# Altium project Rock960 Cape.PrjPcb (part 1 of 2)
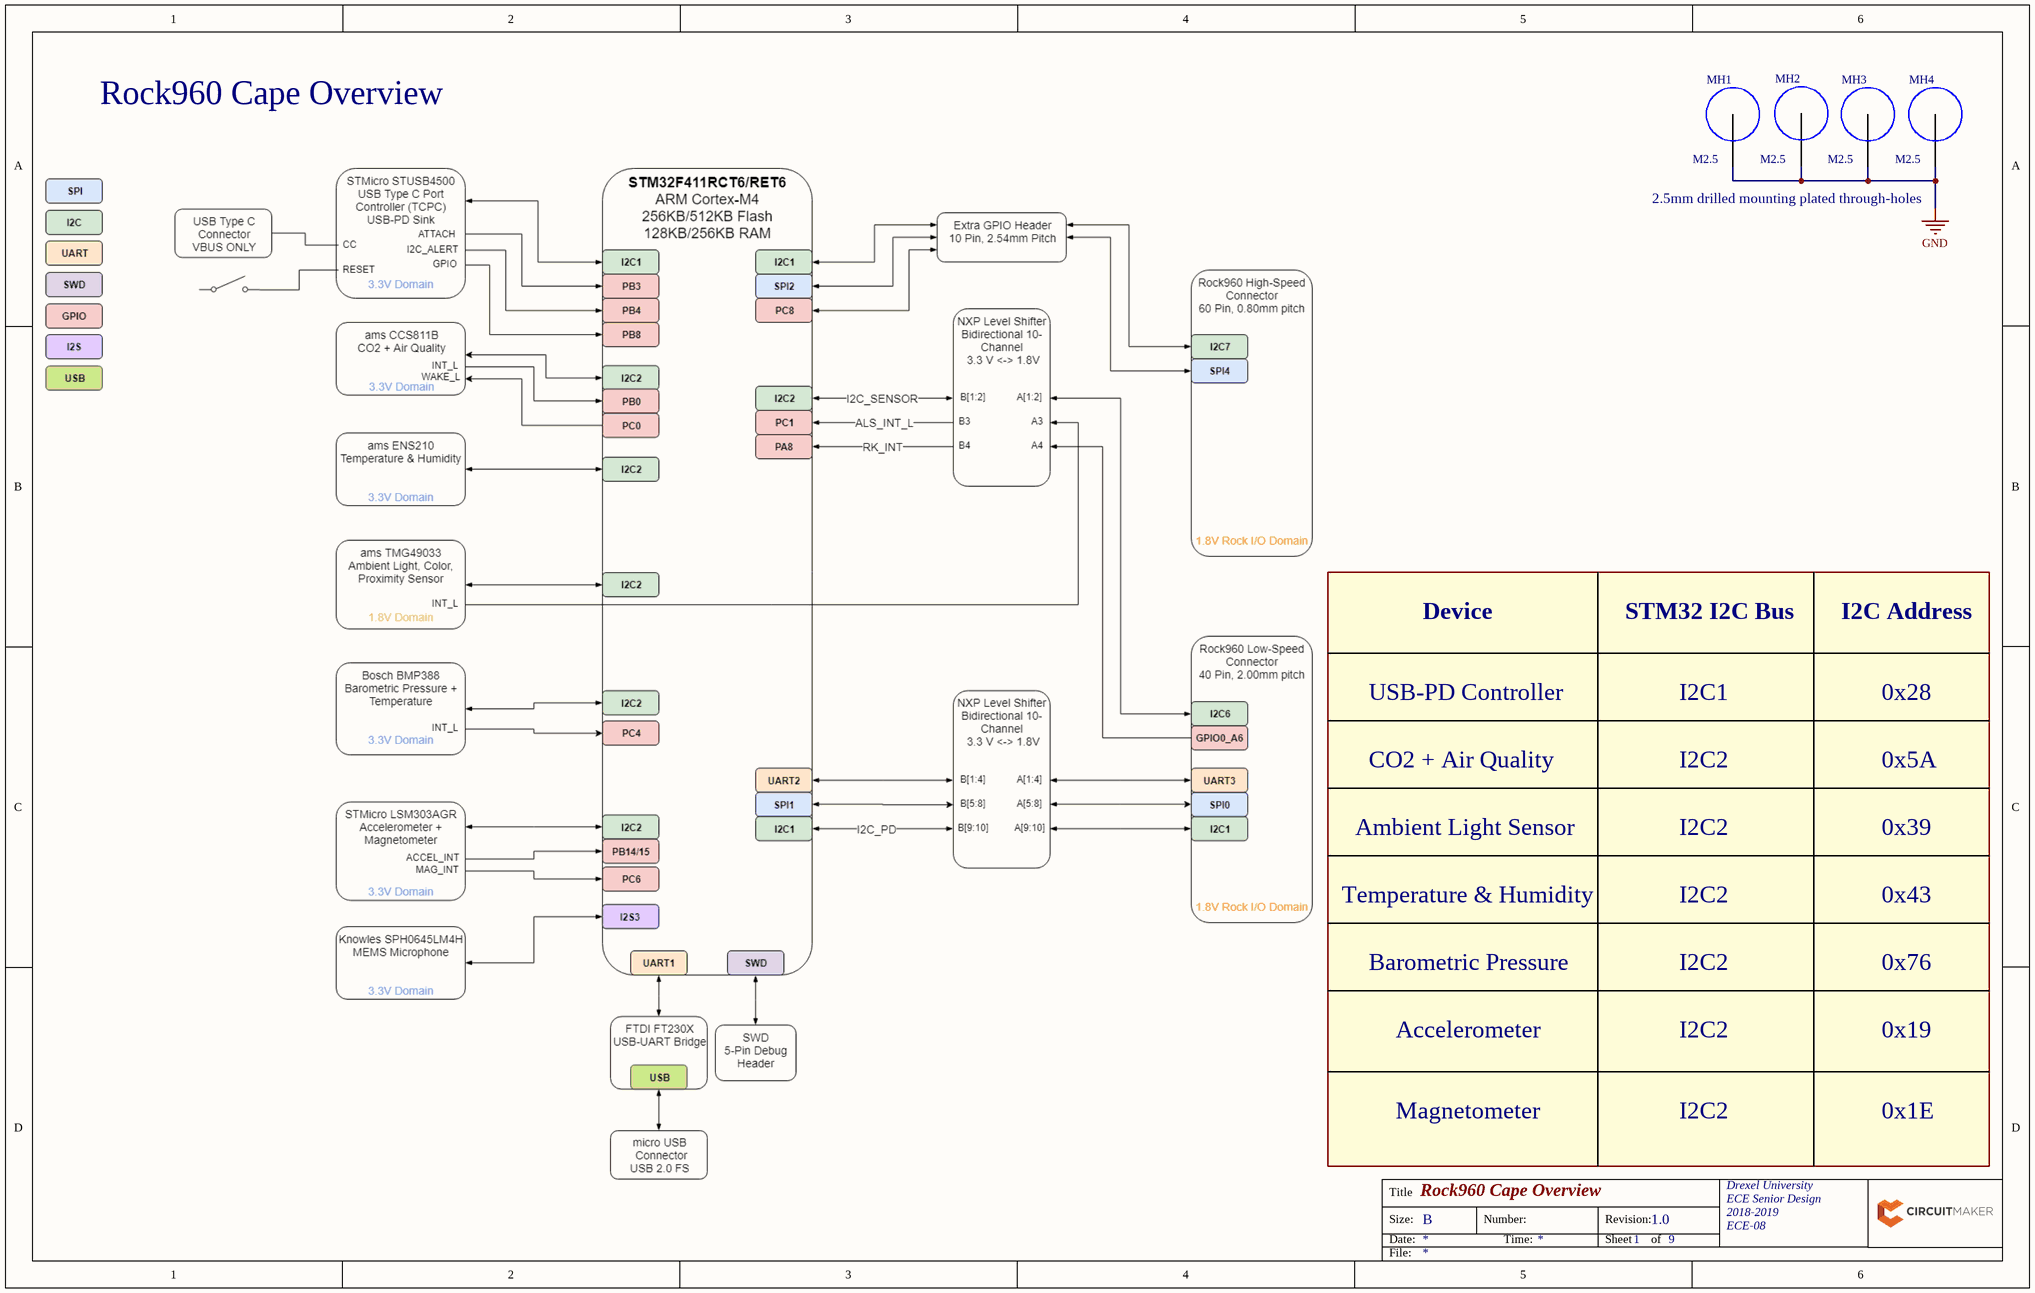
[diagram p0: Cape Overview.SchDoc]
10 sheets, 218 parts. Net scope: flat (ports and power ports of the same name join across sheets).
Sheets:
  Cape Overview.SchDoc
  Board Connectors.SchDoc
  Debug & Test Points.SchDoc
  IO Level Shifters.SchDoc
  USB to UART Bridge.SchDoc
  USB Type C Power Controller.SchDoc
  DC-DC Converters.SchDoc
  STM32F4.SchDoc
  Air Quality Sensors.SchDoc
  Acoustic, Light, Motion Sensors.SchDoc

## Sheet Cape Overview.SchDoc: Rock960 Cape Overview
size B; CompanyName: Drexel University; Organization: Drexel University; Address1: ECE Senior Design; Address2: 2018-2019; Address3: ECE-08; Revision: 1.0; SheetNumber: 1; SheetTotal: 9; ProjectName: Rock960 Cape

### Parts
MH1  M2.5  [PCB-cs3sr3addcss8sioosoo-1]
MH2  M2.5  [PCB-cs3sr3addcss8sioosoo-1]
MH3  M2.5  [PCB-cs3sr3addcss8sioosoo-1]
MH4  M2.5  [PCB-cs3sr3addcss8sioosoo-1]

### Nets
GND: MH1.1 MH2.1 MH3.1 MH4.1

### Notes on the sheet
- Rock960 Cape Overview
- 2.5mm drilled mounting plated through-holes
- Device
- STM32 I2C Bus
- I2C Address
- USB-PD Controller
- I2C1
- 0x28
- CO2 + Air Quality
- I2C2
- 0x5A
- Ambient Light Sensor
- 0x39
- Temperature & Humidity
- 0x43
- Barometric Pressure
- 0x76
- Accelerometer
- 0x19
- Magnetometer
- 0x1E
- Title
- Size:
- Date:
- B
- Number:
- Time:
- Revision:
- Sheet
- of
- File:

### Library data of the parts
MH1-MH4 = CMP-yzeggvgux1nyfm6m4i34-1: Plated Through-Hole Mechanical, 2.5mm drilled, 5.0mm diameter; CustomComponentID: yzeggvgux1nyfm6m4i34

## Sheet Board Connectors.SchDoc: Board Connectors
size B; Organization: Drexel University; Address1: ECE Senior Design; Address2: 2018-2019; Address3: ECE-08; Revision: 1.0; SheetNumber: 2; SheetTotal: 9; ProjectName: Rock960 Cape
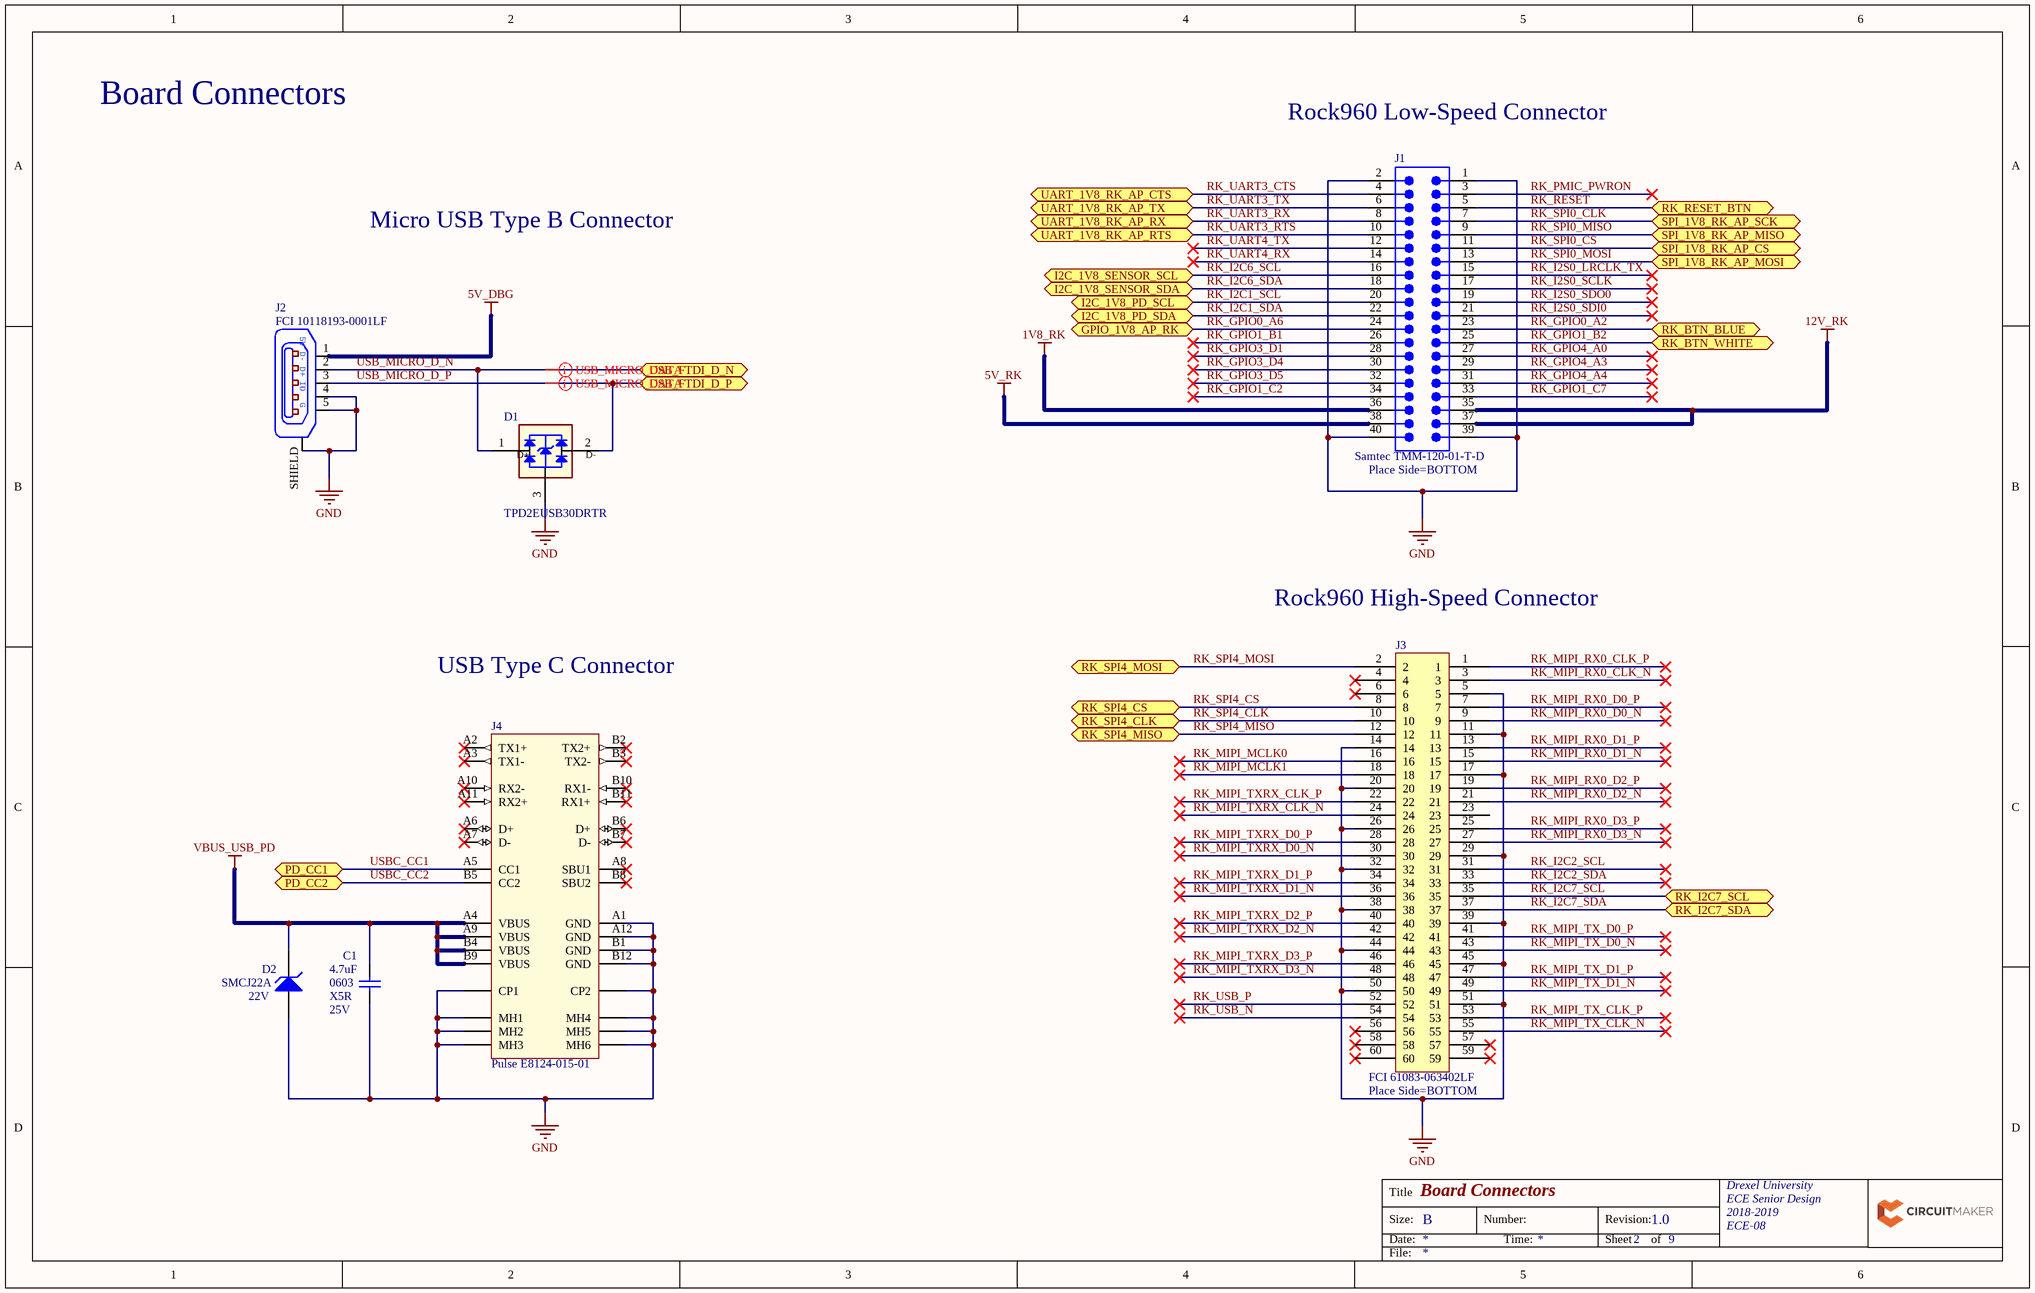
[diagram p1: Board Connectors.SchDoc]

### Parts
C1  Capacitance: 4.7uF  Case/Package: 0603  Dielectric Characteristic: X5R  Voltage Rating (DC): 25V  [CAPC1608X90X35ML10T15]  (hidden comment: Murata GRM188R61E475KE11D)
D1  TPD2EUSB30DRTR  [T_TI_TPD2EUSB30DRTR]
D2  SMCJ22A  Reverse Voltage: 22V  [PCB-gk7qhtajnaxh6qo3xtq4-1]
J1  Samtec TMM-120-01-T-D  [TMM-120-01-T-D]
J2  FCI 10118193-0001LF  [MICRO-USB5+6P-SMD-0.65-B]
J3  FCI 61083-063402LF  [PCB-7ti9pzjasutfjj4nekyo-1]
J4  Pulse E8124-015-01  [PCB-zoek8xqsb2swisfr99my-1]

### Ports
GPIO_1V8_AP_RK, I2C_1V8_PD_SCL (bidir), I2C_1V8_PD_SDA (bidir), I2C_1V8_SENSOR_SCL, I2C_1V8_SENSOR_SDA, PD_CC1 (bidir), PD_CC2 (bidir), RK_BTN_BLUE, RK_BTN_WHITE, RK_I2C7_SCL (bidir), RK_I2C7_SDA (bidir), RK_RESET_BTN, RK_SPI4_CLK (bidir), RK_SPI4_CS (bidir), RK_SPI4_MISO (bidir), RK_SPI4_MOSI (bidir), SPI_1V8_RK_AP_CS, SPI_1V8_RK_AP_MISO, SPI_1V8_RK_AP_MOSI, SPI_1V8_RK_AP_SCK, UART_1V8_RK_AP_CTS, UART_1V8_RK_AP_RTS, UART_1V8_RK_AP_RX, UART_1V8_RK_AP_TX, USB_FTDI_D_N, USB_FTDI_D_P

### Nets
1V8_RK: J1.36
5V_DBG: J2.1
5V_RK: J1.38
12V_RK: J1.35 J1.37
GND: C1.1 D1.3(GND) D2.1(A) J1.1 J1.2 J1.39 J1.40 J2.4 J2.5 J2.SHIELD J3.5 J3.11 J3.14 J3.17 J3.20 J3.26 J3.29 J3.32 J3.38 J3.39 J3.44 J3.45 J3.50 J3.51 J4.A1(GND) J4.A12(GND) J4.B1(GND) J4.B12(GND) J4.CP1 J4.CP2 J4.MH1 J4.MH2 J4.MH3 J4.MH4 J4.MH5 J4.MH6
VBUS_USB_PD: C1.2 D2.2(K) J4.A4(VBUS) J4.A9(VBUS) J4.B4(VBUS) J4.B9(VBUS)
RK_GPIO0_A2: J1.23 ; port RK_BTN_BLUE
RK_GPIO0_A6: J1.24 ; port GPIO_1V8_AP_RK
RK_GPIO1_B1: J1.26
RK_GPIO1_B2: J1.25 ; port RK_BTN_WHITE
RK_GPIO1_C2: J1.34
RK_GPIO1_C7: J1.33
RK_GPIO3_D1: J1.28
RK_GPIO3_D4: J1.30
RK_GPIO3_D5: J1.32
RK_GPIO4_A0: J1.27
RK_GPIO4_A3: J1.29
RK_GPIO4_A4: J1.31
RK_I2C1_SCL: J1.20 ; port I2C_1V8_PD_SCL
RK_I2C1_SDA: J1.22 ; port I2C_1V8_PD_SDA
RK_I2C2_SCL: J3.31
RK_I2C2_SDA: J3.33
RK_I2C6_SCL: J1.16 ; port I2C_1V8_SENSOR_SCL
RK_I2C6_SDA: J1.18 ; port I2C_1V8_SENSOR_SDA
RK_I2C7_SCL: J3.35 ; port RK_I2C7_SCL
RK_I2C7_SDA: J3.37 ; port RK_I2C7_SDA
RK_I2S0_LRCLK_TX: J1.15
RK_I2S0_SCLK: J1.17
RK_I2S0_SDI0: J1.21
RK_I2S0_SDO0: J1.19
RK_MIPI_MCLK0: J3.16
RK_MIPI_MCLK1: J3.18
RK_MIPI_RX0_CLK_N: J3.3
RK_MIPI_RX0_CLK_P: J3.1
RK_MIPI_RX0_D0_N: J3.9
RK_MIPI_RX0_D0_P: J3.7
RK_MIPI_RX0_D1_N: J3.15
RK_MIPI_RX0_D1_P: J3.13
RK_MIPI_RX0_D2_N: J3.21
RK_MIPI_RX0_D2_P: J3.19
RK_MIPI_RX0_D3_N: J3.27
RK_MIPI_RX0_D3_P: J3.25
RK_MIPI_TX_CLK_N: J3.55
RK_MIPI_TX_CLK_P: J3.53
RK_MIPI_TX_D0_N: J3.43
RK_MIPI_TX_D0_P: J3.41
RK_MIPI_TX_D1_N: J3.49
RK_MIPI_TX_D1_P: J3.47
RK_MIPI_TXRX_CLK_N: J3.24
RK_MIPI_TXRX_CLK_P: J3.22
RK_MIPI_TXRX_D0_N: J3.30
RK_MIPI_TXRX_D0_P: J3.28
RK_MIPI_TXRX_D1_N: J3.36
RK_MIPI_TXRX_D1_P: J3.34
RK_MIPI_TXRX_D2_N: J3.42
RK_MIPI_TXRX_D2_P: J3.40
RK_MIPI_TXRX_D3_N: J3.48
RK_MIPI_TXRX_D3_P: J3.46
RK_PMIC_PWRON: J1.3
RK_RESET: J1.5 ; port RK_RESET_BTN
RK_SPI0_CLK: J1.7 ; port SPI_1V8_RK_AP_SCK
RK_SPI0_CS: J1.11 ; port SPI_1V8_RK_AP_CS
RK_SPI0_MISO: J1.9 ; port SPI_1V8_RK_AP_MISO
RK_SPI0_MOSI: J1.13 ; port SPI_1V8_RK_AP_MOSI
RK_SPI4_CLK: J3.10 ; port RK_SPI4_CLK
RK_SPI4_CS: J3.8 ; port RK_SPI4_CS
RK_SPI4_MISO: J3.12 ; port RK_SPI4_MISO
RK_SPI4_MOSI: J3.2 ; port RK_SPI4_MOSI
RK_UART3_CTS: J1.4 ; port UART_1V8_RK_AP_CTS
RK_UART3_RTS: J1.10 ; port UART_1V8_RK_AP_RTS
RK_UART3_RX: J1.8 ; port UART_1V8_RK_AP_RX
RK_UART3_TX: J1.6 ; port UART_1V8_RK_AP_TX
RK_UART4_RX: J1.14
RK_UART4_TX: J1.12
RK_USB_N: J3.54
RK_USB_P: J3.52
USB_MICRO_D_N: D1.1(D+) J2.2 ; port USB_FTDI_D_N
USB_MICRO_D_P: D1.2(D-) J2.3 ; port USB_FTDI_D_P
USBC_CC1: J4.A5(CC1) ; port PD_CC1
USBC_CC2: J4.B5(CC2) ; port PD_CC2

Not connected (* = marked no-connect by the designer): J3 4* 6* 23 56* 57* 58* 59* 60*; J4 A2(TX1+)* A3(TX1-)* A6(D+)* A7(D-)* A8(SBU1)* A10(RX2-)* A11(RX2+)* B2(TX2+)* B3(TX2-)* B6(D+)* B7(D-)* B8(SBU2)* B10(RX1-)* B11(RX1+)*

### Layout directives
differential pair: USB_MICRO_D_N, USB_MICRO_D_P

### Notes on the sheet
- Board Connectors
- Rock960 Low-Speed Connector
- Micro USB Type B Connector
- (near J1) Place Side=BOTTOM
- Rock960 High-Speed Connector
- USB Type C Connector
- (near J3) Place Side=BOTTOM
- Title
- Size:
- Date:
- B
- Number:
- Time:
- Revision:
- Sheet
- of
- File:
- (in symbol CMP-b7d77f99eeaa6810-17) 5V; D-; D+; ID; G

### Library data of the parts
C1 = CMP-8856396-4: CAP CER 4.7UF 25V 10% X5R 0603; Capacitance Tolerance: ±10%; Lifecycle Status: Active; Octopart Url: https://octopart.com/grm188r61e475ke11d-murata-26982327; OctopartID: 0176c9e793a7deb1; Packaging: Cut Tape (CT); REACH SVHC Compliance: No SVHC; RoHS: Compliant; Size-Length: 0.0016 m; Size-Thickness: 0.0008 m; Size-Width: 0.0008 m; Manufacturer Part Number: GRM188R61E475KE11D
D1 = CMP-19307392-6: 2-Channel ESD Solution for SuperSpeed USB 3.0 Interface 3-SOT -40 to 85; Manufacturer Name: Texas Instruments; Lead-Free Status: Lead Free; Number of Channels: 2; Operating Voltage: 5.5V; Clamp Voltage: 8.0V; Capacitance: 700 fF; Manufacturer Part No.: TPD2EUSB30DRTR; Number of Pins: 3; RoHS: Compliant; Packaging: Tape & Reel (TR), Cut Tape (CT); Lifecycle Status: Active; Manufacturer Part Number: TPD2EUSB30DRTR; Octopart URL: http://octopart.com/tpd2eusb30drtr-texas+instruments-18093488; REACH SVHC Compliance: No SVHC; OctopartID: 42478a5972919d80
D2 = CMP-9cf25530e9434335-1: SMCJ Series 35.5 V 1.5 kW Surface Mount Uni-Directional TVS Diode - DO-214AB
J1 = CMP-43228a2c51039ce5-1: Conn Unshrouded Header HDR 40 POS 2mm Solder ST Thru-Hole; Gender: Male; Lead-Free Status: Lead Free; Number of Contacts: 40; Pin Pitch: 2.00 mm; Octopart URL: https://octopart.com/tmm-120-01-t-d-samtec-276295; Manufacturer Part Number: TMM-120-01-T-D; Color: Black; Contact Material: Phosphor Bronze; Contact Plating: Tin; Housing Color: Black; Housing Material: Plastic; Mounting Style: Through Hole, Vertical; Number of Positions: 40; Number of Rows: 2; Operating Temperature: 105 °C (max); Packaging: Tube; REACH SVHC Compliance: No SVHC; RoHS: Compliant; Size-Height: 1.50 mm; Size-Length: 40.0 mm; Size-Width: 3.94 mm; OctopartID: 43228a2c51039ce5
J2 = CMP-b7d77f99eeaa6810-17: Conn Micro USB Type B RCP 5 POS 0.65mm Solder RA SMD 5 Terminal 1 Port T/R
J3 = CMP-fca037f0475d2367-2: Bergstak® : 60 Positions; Dual Row; BTBVertical Header tape & Reel; Gender: Male; Pin Pitch: 800 µm; Contact Resistance: 50.0 mΩ (max); Number of Contacts: 60; Flammability Rating: UL 94 V-0; Orientation: Vertical; Contact Plating: Gold; Size-Height: 6.70 mm; RoHS: Compliant; Mounting Style: Surface Mount, Vertical; Size-Length: 29.8 mm; Number of Rows: 2; Contact Material: Brass; OctopartID: fca037f0475d2367
J4 = CMP-5cde91da6a388319-4: Conn USB Type C RCP 24 POS 0.5mm Solder RA SMD 24 Terminal 1 Port

## Sheet Debug & Test Points.SchDoc: Debug & Test Points
size B; Organization: Drexel University; Address1: ECE Senior Design; Address2: 2018-2019; Address3: ECE-08; Revision: 1.0; SheetNumber: 3; SheetTotal: 9; PageSetup: Record=PageOptions|CenterHorizontal=True|CenterVertical=True|PrintScale=1.00|XCorrection=1.00|YCorrection=1.00|PrintKind=0|BorderSize=5000000|LeftOffset=0|BottomOffset=0|Orientation=2|PaperLength=1000|PaperWidth=1000|Scale=100|PaperSource=7|PrintQuality=-3|MediaType=1|DitherType=10|PrintScaleMode=1|PaperKind=Letter|PaperIndex=1
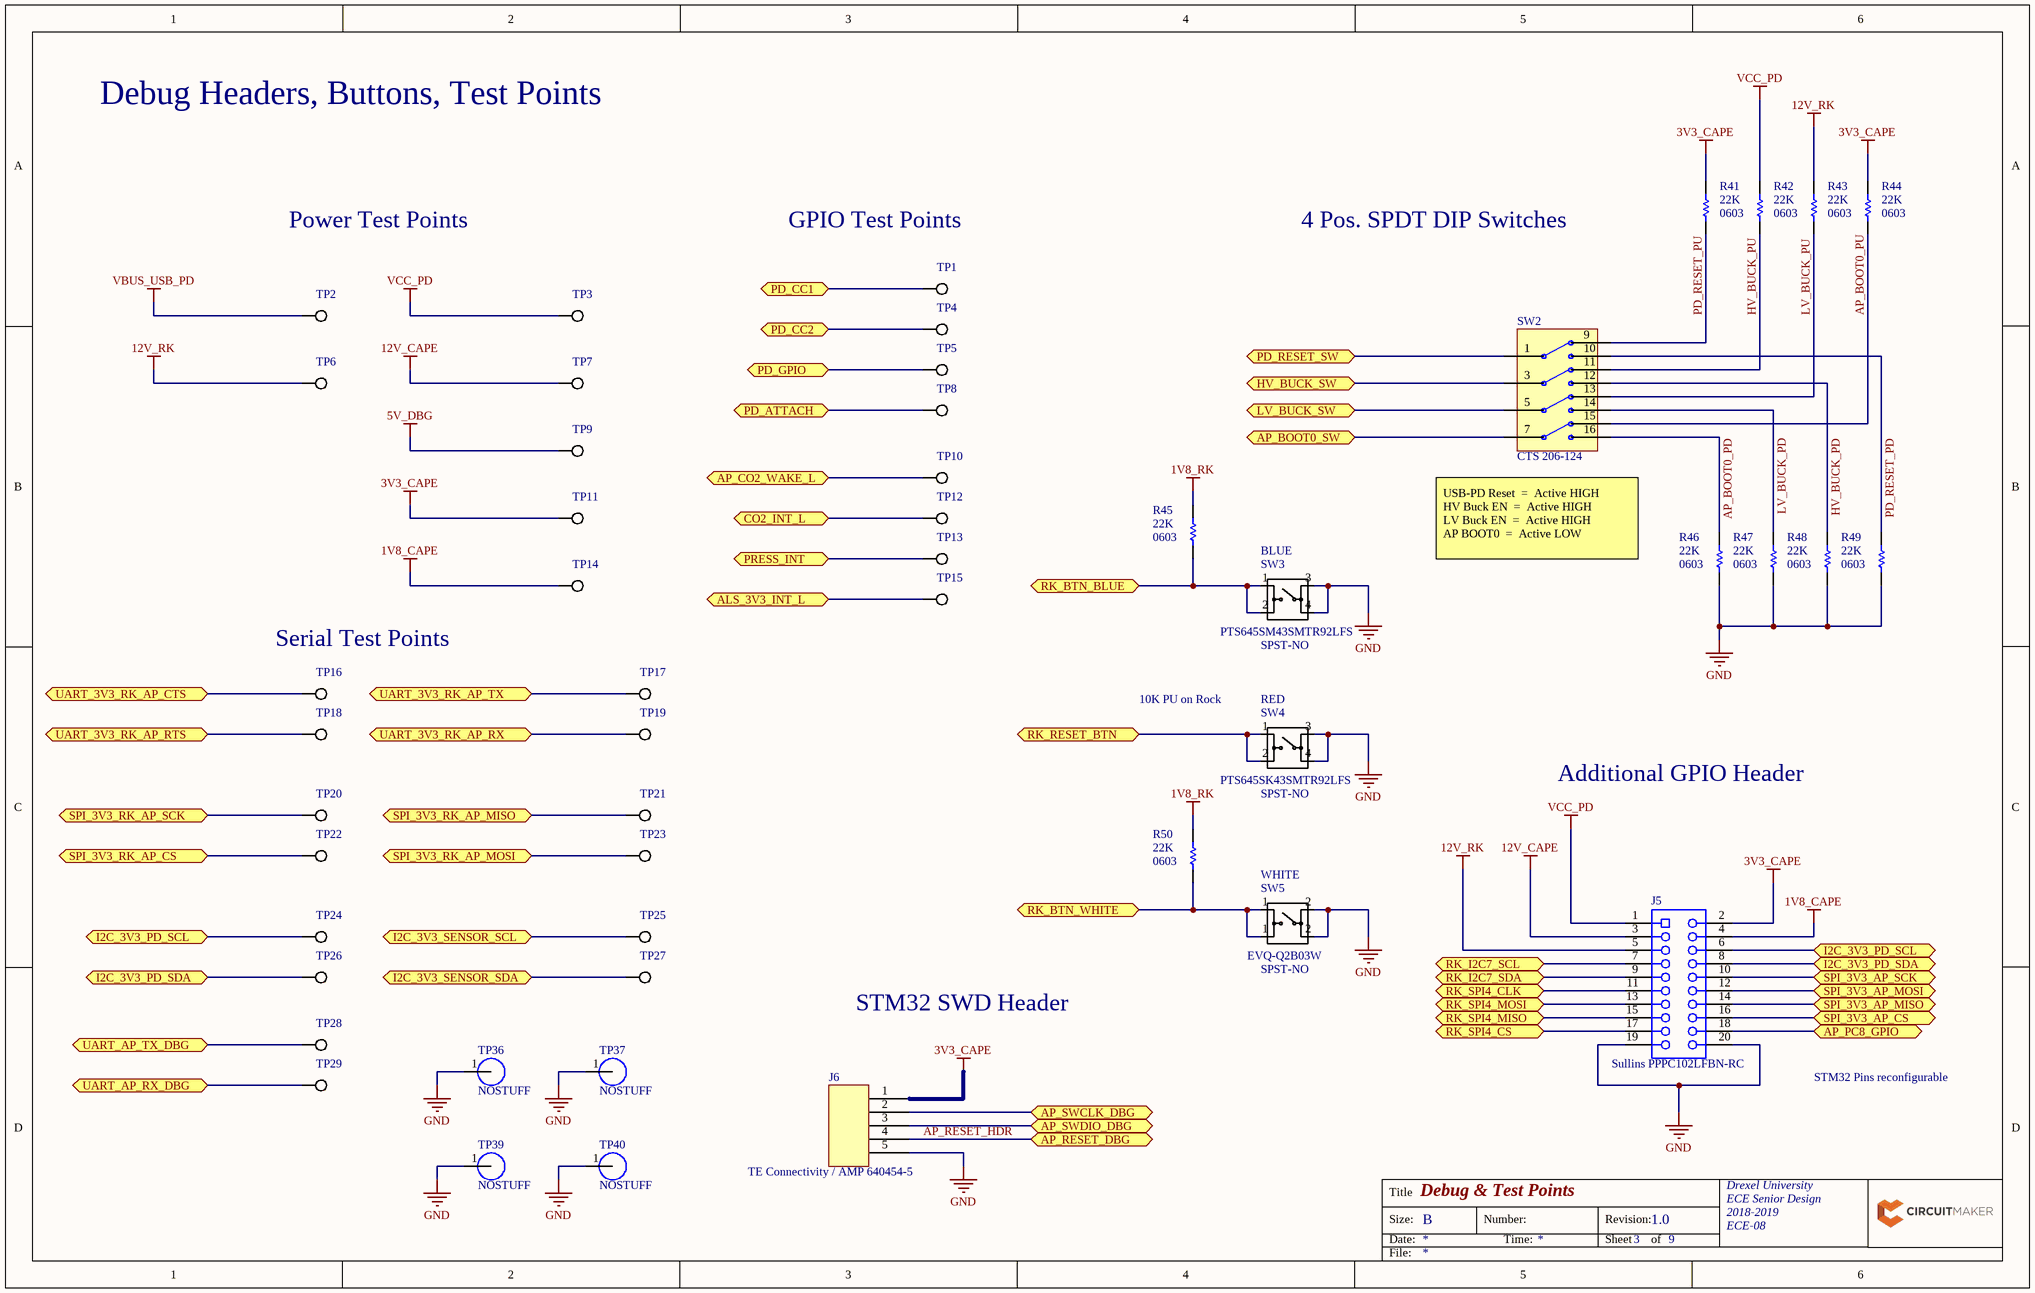
[diagram p2: Debug & Test Points.SchDoc]

### Parts
J5  Sullins PPPC102LFBN-RC  [SLIN-PPPC102LFBN-RC_V]
J6  TE Connectivity / AMP 640454-5  [PCB-cjz7utnpmh9dagnjcosy-1]
R41  Resistance: 22K  Case/Package: 0603  [RESC1608X55X25LL10T15]  (hidden comment: Yageo RC0603FR-0722KL)
R42  Resistance: 22K  Case/Package: 0603  [RESC1608X55X25LL10T15]  (hidden comment: Yageo RC0603FR-0722KL)
R43  Resistance: 22K  Case/Package: 0603  [RESC1608X55X25LL10T15]  (hidden comment: Yageo RC0603FR-0722KL)
R44  Resistance: 22K  Case/Package: 0603  [RESC1608X55X25LL10T15]  (hidden comment: Yageo RC0603FR-0722KL)
R45  Resistance: 22K  Case/Package: 0603  [RESC1608X55X25LL10T15]  (hidden comment: Yageo RC0603FR-0722KL)
R46  Resistance: 22K  Case/Package: 0603  [RESC1608X55X25LL10T15]  (hidden comment: Yageo RC0603FR-0722KL)
R47  Resistance: 22K  Case/Package: 0603  [RESC1608X55X25LL10T15]  (hidden comment: Yageo RC0603FR-0722KL)
R48  Resistance: 22K  Case/Package: 0603  [RESC1608X55X25LL10T15]  (hidden comment: Yageo RC0603FR-0722KL)
R49  Resistance: 22K  Case/Package: 0603  [RESC1608X55X25LL10T15]  (hidden comment: Yageo RC0603FR-0722KL)
R50  Resistance: 22K  Case/Package: 0603  [RESC1608X55X25LL10T15]  (hidden comment: Yageo RC0603FR-0722KL)
SW2  CTS 206-124  [PCB-nbvsi55tyuro9im52r90-1]
SW3  Manufacturer Part Number: PTS645SM43SMTR92LFS  Contacts Type: SPST-NO  [PCB-s4cw3ztviwh2470uqn6q-1]  (hidden comment: C&K Components PTS645SM43SMTR92LFS)
SW4  Manufacturer Part Number: PTS645SK43SMTR92LFS  Contacts Type: SPST-NO  [PCB-2l25iuk5dcek232nr8ss-1]  (hidden comment: C&K Components PTS645SK43SMTR92LFS)
SW5  Manufacturer Part Number: EVQ-Q2B03W  Contacts Type: SPST-NO  [PCB-772q97a3nev1hwheshwj-1]  (hidden comment: Panasonic EVQ-Q2B03W)
TP1  SYM-r3tntvff39g057zxjnnx-1  [PCB-hew5anfrhkqvtgt23eko-1]  (value not drawn)
TP2  SYM-r3tntvff39g057zxjnnx-1  [PCB-hew5anfrhkqvtgt23eko-1]  (value not drawn)
TP3  SYM-r3tntvff39g057zxjnnx-1  [PCB-hew5anfrhkqvtgt23eko-1]  (value not drawn)
TP4  SYM-r3tntvff39g057zxjnnx-1  [PCB-hew5anfrhkqvtgt23eko-1]  (value not drawn)
TP5  SYM-r3tntvff39g057zxjnnx-1  [PCB-hew5anfrhkqvtgt23eko-1]  (value not drawn)
TP6  SYM-r3tntvff39g057zxjnnx-1  [PCB-hew5anfrhkqvtgt23eko-1]  (value not drawn)
TP7  SYM-r3tntvff39g057zxjnnx-1  [PCB-hew5anfrhkqvtgt23eko-1]  (value not drawn)
TP8  SYM-r3tntvff39g057zxjnnx-1  [PCB-hew5anfrhkqvtgt23eko-1]  (value not drawn)
TP9  SYM-r3tntvff39g057zxjnnx-1  [PCB-hew5anfrhkqvtgt23eko-1]  (value not drawn)
TP10  SYM-r3tntvff39g057zxjnnx-1  [PCB-hew5anfrhkqvtgt23eko-1]  (value not drawn)
TP11  SYM-r3tntvff39g057zxjnnx-1  [PCB-hew5anfrhkqvtgt23eko-1]  (value not drawn)
TP12  SYM-r3tntvff39g057zxjnnx-1  [PCB-hew5anfrhkqvtgt23eko-1]  (value not drawn)
TP13  SYM-r3tntvff39g057zxjnnx-1  [PCB-hew5anfrhkqvtgt23eko-1]  (value not drawn)
TP14  SYM-r3tntvff39g057zxjnnx-1  [PCB-hew5anfrhkqvtgt23eko-1]  (value not drawn)
TP15  SYM-r3tntvff39g057zxjnnx-1  [PCB-hew5anfrhkqvtgt23eko-1]  (value not drawn)
TP16  SYM-r3tntvff39g057zxjnnx-1  [PCB-hew5anfrhkqvtgt23eko-1]  (value not drawn)
TP17  SYM-r3tntvff39g057zxjnnx-1  [PCB-hew5anfrhkqvtgt23eko-1]  (value not drawn)
TP18  SYM-r3tntvff39g057zxjnnx-1  [PCB-hew5anfrhkqvtgt23eko-1]  (value not drawn)
TP19  SYM-r3tntvff39g057zxjnnx-1  [PCB-hew5anfrhkqvtgt23eko-1]  (value not drawn)
TP20  SYM-r3tntvff39g057zxjnnx-1  [PCB-hew5anfrhkqvtgt23eko-1]  (value not drawn)
TP21  SYM-r3tntvff39g057zxjnnx-1  [PCB-hew5anfrhkqvtgt23eko-1]  (value not drawn)
TP22  SYM-r3tntvff39g057zxjnnx-1  [PCB-hew5anfrhkqvtgt23eko-1]  (value not drawn)
TP23  SYM-r3tntvff39g057zxjnnx-1  [PCB-hew5anfrhkqvtgt23eko-1]  (value not drawn)
TP24  SYM-r3tntvff39g057zxjnnx-1  [PCB-hew5anfrhkqvtgt23eko-1]  (value not drawn)
TP25  SYM-r3tntvff39g057zxjnnx-1  [PCB-hew5anfrhkqvtgt23eko-1]  (value not drawn)
TP26  SYM-r3tntvff39g057zxjnnx-1  [PCB-hew5anfrhkqvtgt23eko-1]  (value not drawn)
TP27  SYM-r3tntvff39g057zxjnnx-1  [PCB-hew5anfrhkqvtgt23eko-1]  (value not drawn)
TP28  SYM-r3tntvff39g057zxjnnx-1  [PCB-hew5anfrhkqvtgt23eko-1]  (value not drawn)
TP29  SYM-r3tntvff39g057zxjnnx-1  [PCB-hew5anfrhkqvtgt23eko-1]  (value not drawn)
TP36  Keystone 5015  [PCB-57fxnr3lnfj79tb7d57h-1]  (value not drawn)  (no BOM)
TP37  Keystone 5015  [PCB-57fxnr3lnfj79tb7d57h-1]  (value not drawn)  (no BOM)
TP39  Keystone 5015  [PCB-57fxnr3lnfj79tb7d57h-1]  (value not drawn)  (no BOM)
TP40  Keystone 5015  [PCB-57fxnr3lnfj79tb7d57h-1]  (value not drawn)  (no BOM)

### Ports
ALS_3V3_INT_L, AP_BOOT0_SW, AP_CO2_WAKE_L, AP_PC8_GPIO, AP_RESET_DBG, AP_SWCLK_DBG, AP_SWDIO_DBG, CO2_INT_L, HV_BUCK_SW, I2C_3V3_PD_SCL, I2C_3V3_PD_SCL (bidir), I2C_3V3_PD_SDA, I2C_3V3_PD_SDA (bidir), I2C_3V3_SENSOR_SCL, I2C_3V3_SENSOR_SDA, LV_BUCK_SW, PD_ATTACH, PD_CC1 (bidir), PD_CC2 (bidir), PD_GPIO, PD_RESET_SW (bidir), PRESS_INT, RK_BTN_BLUE, RK_BTN_WHITE, RK_I2C7_SCL (bidir), RK_I2C7_SDA (bidir), RK_RESET_BTN, RK_SPI4_CLK (bidir), RK_SPI4_CS (bidir), RK_SPI4_MISO (bidir), RK_SPI4_MOSI (bidir), SPI_3V3_AP_CS, SPI_3V3_AP_MISO, SPI_3V3_AP_MOSI, SPI_3V3_AP_SCK, SPI_3V3_RK_AP_CS, SPI_3V3_RK_AP_MISO, SPI_3V3_RK_AP_MOSI, SPI_3V3_RK_AP_SCK, UART_3V3_RK_AP_CTS, UART_3V3_RK_AP_RTS, UART_3V3_RK_AP_RX, UART_3V3_RK_AP_TX, UART_AP_RX_DBG, UART_AP_TX_DBG

### Nets
1V8_CAPE: J5.4 TP14.1
1V8_RK: R45.2 R50.2
3V3_CAPE: J5.2 J6.1 R41.2 R44.2 TP11.1
5V_DBG: TP9.1
12V_CAPE: J5.3 TP7.1
12V_RK: J5.5 R43.2 TP6.1
GND: J5.19 J5.20 J6.5 R46.1 R47.1 R48.1 R49.1 SW3.3 SW3.4 SW4.3 SW4.4 SW5.2 TP36.1 TP37.1 TP39.1 TP40.1
VBUS_USB_PD: TP2.1
VCC_PD: J5.1 R42.2 TP3.1
AP_BOOT0_PD: R46.2 SW2.16
AP_BOOT0_PU: R44.1 SW2.15
AP_BOOT0_SEL: SW2.7 ; port AP_BOOT0_SW
AP_I2C1_SCL: J5.6 TP24.1 ; port I2C_3V3_PD_SCL
AP_I2C1_SDA: J5.8 TP26.1 ; port I2C_3V3_PD_SDA
AP_I2C2_SCL: TP25.1 ; port I2C_3V3_SENSOR_SCL
AP_I2C2_SDA: TP27.1 ; port I2C_3V3_SENSOR_SDA
AP_PB1_CO2_INT: TP12.1 ; port CO2_INT_L
AP_PB4_PD_ATTACH: TP8.1 ; port PD_ATTACH
AP_PB8_PD_GPIO: TP5.1 ; port PD_GPIO
AP_PC0_CO2_WAKE_L: TP10.1 ; port AP_CO2_WAKE_L
AP_PC1_ALS_INT_L: TP15.1 ; port ALS_3V3_INT_L
AP_PC4_PRESS_INT: TP13.1 ; port PRESS_INT
AP_PC8: J5.18 ; port AP_PC8_GPIO
AP_RESET_HDR: J6.4 ; port AP_RESET_DBG
AP_SPI1_MISO: TP21.1 ; port SPI_3V3_RK_AP_MISO
AP_SPI1_MOSI: TP23.1 ; port SPI_3V3_RK_AP_MOSI
AP_SPI1_SCK: TP20.1 ; port SPI_3V3_RK_AP_SCK
AP_SPI1_SLAVE_NSS: TP22.1 ; port SPI_3V3_RK_AP_CS
AP_SPI2_MISO: J5.14 ; port SPI_3V3_AP_MISO
AP_SPI2_MOSI: J5.12 ; port SPI_3V3_AP_MOSI
AP_SPI2_MSTR_NSS: J5.16 ; port SPI_3V3_AP_CS
AP_SPI2_SCK: J5.10 ; port SPI_3V3_AP_SCK
AP_SWCLK: J6.2 ; port AP_SWCLK_DBG
AP_SWDIO: J6.3 ; port AP_SWDIO_DBG
AP_UART1_RX: TP29.1 ; port UART_AP_RX_DBG
AP_UART1_TX: TP28.1 ; port UART_AP_TX_DBG
AP_UART2_CTS: TP18.1 ; port UART_3V3_RK_AP_RTS
AP_UART2_RTS: TP16.1 ; port UART_3V3_RK_AP_CTS
AP_UART2_RX: TP17.1 ; port UART_3V3_RK_AP_TX
AP_UART2_TX: TP19.1 ; port UART_3V3_RK_AP_RX
HV_BUCK_EN: SW2.3 ; port HV_BUCK_SW
HV_BUCK_PD: R48.2 SW2.12
HV_BUCK_PU: R42.1 SW2.11
LV_BUCK_EN: SW2.5 ; port LV_BUCK_SW
LV_BUCK_PD: R47.2 SW2.14
LV_BUCK_PU: R43.1 SW2.13
PD_RESET: SW2.1 ; port PD_RESET_SW
PD_RESET_PD: R49.2 SW2.10
PD_RESET_PU: R41.1 SW2.9
RK_GPIO0_A2: R45.1 SW3.1 SW3.2 ; port RK_BTN_BLUE
RK_GPIO1_B2: R50.1 SW5.1 ; port RK_BTN_WHITE
RK_I2C7_SCL: J5.7 ; port RK_I2C7_SCL
RK_I2C7_SDA: J5.9 ; port RK_I2C7_SDA
RK_RESET: SW4.1 SW4.2 ; port RK_RESET_BTN
RK_SPI4_CLK: J5.11 ; port RK_SPI4_CLK
RK_SPI4_CS: J5.17 ; port RK_SPI4_CS
RK_SPI4_MISO: J5.15 ; port RK_SPI4_MISO
RK_SPI4_MOSI: J5.13 ; port RK_SPI4_MOSI
USBC_CC1: TP1.1 ; port PD_CC1
USBC_CC2: TP4.1 ; port PD_CC2

### Notes on the sheet
- Debug Headers, Buttons, Test Points
- Power Test Points
- GPIO Test Points
- 4 Pos. SPDT DIP Switches
- (near SW3) BLUE
- (near SW2) USB-PD Reset  =  Active HIGH
  HV Buck EN  =  Active HIGH
  LV Buck EN  =  Active HIGH
  AP BOOT0  =  Active LOW
- (near TP16) Serial Test Points
- 10K PU on Rock
- (near SW4) RED
- Additional GPIO Header
- (near SW5) WHITE
- STM32 SWD Header
- STM32 Pins reconfigurable
- Title
- Size:
- Date:
- B
- Number:
- Time:
- Revision:
- Sheet
- of
- File:
- (in symbol CMP-0dc8c4c22640d20f-15) NOSTUFF

### Library data of the parts
J5 = CMP-dcfd15f3db31033a-2: Female Header, Pitch 2.54 mm, 2 x 10 Position, Height 8.75 mm, Tail Length 3.2 mm, -40 to 105 degC, RoHS, Bulk; Pin Pitch: 2.54 mm; Number of Positions: 20; Lead-Free Status: Lead Free; Housing Material: Plastic; ComponentLink1Description: Datasheet; RoHS: Compliant; Number of Rows: 2; Contact Plating: Gold; Octopart Url: http://octopart.com/pppc102lfbn-rc-sullins-271018; Contact Material: Phosphor Bronze; DatasheetVersion: Rev. D, 10/2007; Size-Height: 8.50 mm; Size-Width: 5.00 mm; Seller Landing  Url: https://octopart.com/click/track?country=US&ak=8157f166&sig=09905bc&sid=459&ppid=271018&vpid=1792693&ct=offers; ComponentLink1URL: http://datasheet.octopart.com/PPPC102LFBN-RC-Sullins-datasheet-8327184.pdf; Mounting Style: Through Hole; PackageDescription: Female Header, Pitch 2.54 mm, 2 x 10 Position, Height 8.75 mm, Tail Length 3.2 mm; PackageReference: PPPC102LFBN-RC; OctopartID: dcfd15f3db31033a; Manufacturer Part Number: PPPC102LFBN-RC; Size-Length: 25.9 mm
J6 = CMP-334df81e3a21ec8a-6: MTA-100 5 Position 2.54 mm Single Row Through-Hole Straight Wire to Board Header; Pin Pitch: 2.54 mm; Mounting Angle: 180 °; ELV Compliant: Compliant; Current Rating: 4.00 A; Gender: Male; Number of Contacts: 5; Lead-Free Status: Lead Free; Shrouded: No; Voltage Rating (AC): 250 V; Contact Plating: Tin; OctopartID: 334df81e3a21ec8a; Packaging: Bag; Orientation: Vertical; Mounting Style: Through Hole, Vertical; Contact Material: Copper Alloy; Size-Height: 7.87 mm; Octopart URL: http://octopart.com/640454-5-te+connectivity+%2F+amp-39398410; Housing Color: Natural; Size-Length: 12.7 mm; Number of Positions: 5; Flammability Rating: UL 94 V-0; Manufacturer Part Number: 640454-5; Lifecycle Status: Active; Number of Rows: 1; Size-Width: 5.71 mm; RoHS: Compliant; Housing Material: Polyester; REACH SVHC Compliance: No SVHC
R41-R50 = CMP-1853446-5: Chip Resistor, 22 KOhm, +/- 1%, 0.1 W, -55 to 155 degC, 0603 (1608 Metric), RoHS, Tape and Reel; Power Rating: 1/10W; Voltage Rating (DC): 50.0 V; Lead-Free Status: Lead Free; Case/Package (SI): 1608; Number of Pins: 2; Size-Height: 450 µm; Resistance Tolerance: 1%; PackageDescription: 2-Pin Surface Mount Device, Body 1.6 x 0.8 mm; Size-Width: 800 µm; Seller Landing  Url: https://octopart-clicks.com/click/track?country=US&ak=8157f166&sig=0952a08&sid=5489&ppid=40952860&vpid=270386233&ct=offers; DatasheetVersion: Rev. 4, 02/2016; PackageReference: 0603; Size-Length: 1.60 mm; RoHS: Compliant; Mounting Style: Surface Mount; OctopartID: 2162ea18e018fea5; Manufacturer Part Number: RC0603FR-0722KL; Packaging: Cut Tape (CT), Tape & Reel (TR); Octopart Url: http://octopart.com/rc0603fr-0722kl-yageo-40952860; REACH SVHC Compliance: No SVHC
SW2 = CMP-9d2d5432b3d942ea-1: Switch DIP OFF ON SPDT 4 Raised Slide 0.05A 24VDC PC Pins 10000Cycles 2.54mm Thru-Hole Tube; Actuator Type: Standard; Carry Current: 100 mA (max); Lead-Free Status: Contains Lead; Number of Positions: 4; Octopart URL: https://octopart.com/206-124-cts+components-1379218; Manufacturer Part Number: 206-124; Contacts Type: SPDT; Mounting Style: Through Hole; Operating Temperature: 85.0 °C (max); Orientation: Vertical; Pin Pitch: 2.54 mm; RoHS: Compliant; Size-Height: 7.62 mm; Size-Width: 22.5 mm; OctopartID: 9d2d5432b3d942ea
SW3 = CMP-3c47f600356ce380-14: Switch Tactile N.O. SPST Round Button Gull Wing 0.05A 12VDC 100000Cycles 1.57N SMD T/R; Lead-Free Status: Lead Free; OctopartID: 3c47f600356ce380; REACH SVHC Compliance: No SVHC; Packaging: Tape & Reel (TR); Octopart URL: http://octopart.com/pts645sm43smtr92lfs-c%26k+components-55389261; Size-Height: 4.30 mm; RoHS: Compliant; Mounting Style: Surface Mount
SW4 = CMP-8f9845df1015505f-1: Switch Tactile N.O SPST Round Button Gull Wing 0.05A 12VDC 100000Cycle 2.55N SMD T/R; Lead-Free Status: Lead Free; Octopart URL: https://octopart.com/pts645sk43smtr92lfs-c%26k+components-55425771; Mounting Style: Surface Mount; Packaging: Tape & Reel (TR); REACH SVHC Compliance: No SVHC; RoHS: Compliant; Size-Height: 4.30 mm; OctopartID: 8f9845df1015505f
SW5 = CMP-0c8bc5972372d34c-1: Switch Tactile ON OFF SPST Round Button J-Bend 0.02A 15VDC 0.5N SMD Embossed T/R; Actuator Type: Standard; Contact Current Rating: 20.0 mA; Contact Resistance: 100 m? (max); Lead-Free Status: Lead Free; Operating Force: 500 m; Octopart URL: https://octopart.com/evq-q2b03w-panasonic-1444511; Color: White; Lifecycle Status: Not Listed by Manufacturer; Mounting Style: Surface Mount; Operating Temperature: -40.0 °C (min); Orientation: Vertical; REACH SVHC Compliance: No SVHC; RoHS: Compliant; Size-Height: 3.10 mm; Size-Length: 6.50 mm; Size-Thickness: 1.80 mm; Size-Width: 6.00 mm; OctopartID: 0c8bc5972372d34c
TP1-TP29 = CMP-r3tntvff39g057zxjnnx-3: SMT Pad Test Point 1.27mm Diameter
TP36 TP37 TP39 TP40 = CMP-0dc8c4c22640d20f-15: Test Point; Micro Mini; SMT; Phos Bronze/Silver; 1000pc Tape & Reel; Material: Phosphor Bronze

## Sheet IO Level Shifters.SchDoc: IO Level Shifters
size B; Organization: Drexel University; Address1: ECE Senior Design; Address2: 2018-2019; Address3: ECE-08; Revision: 1.0; SheetNumber: 4; SheetTotal: 9
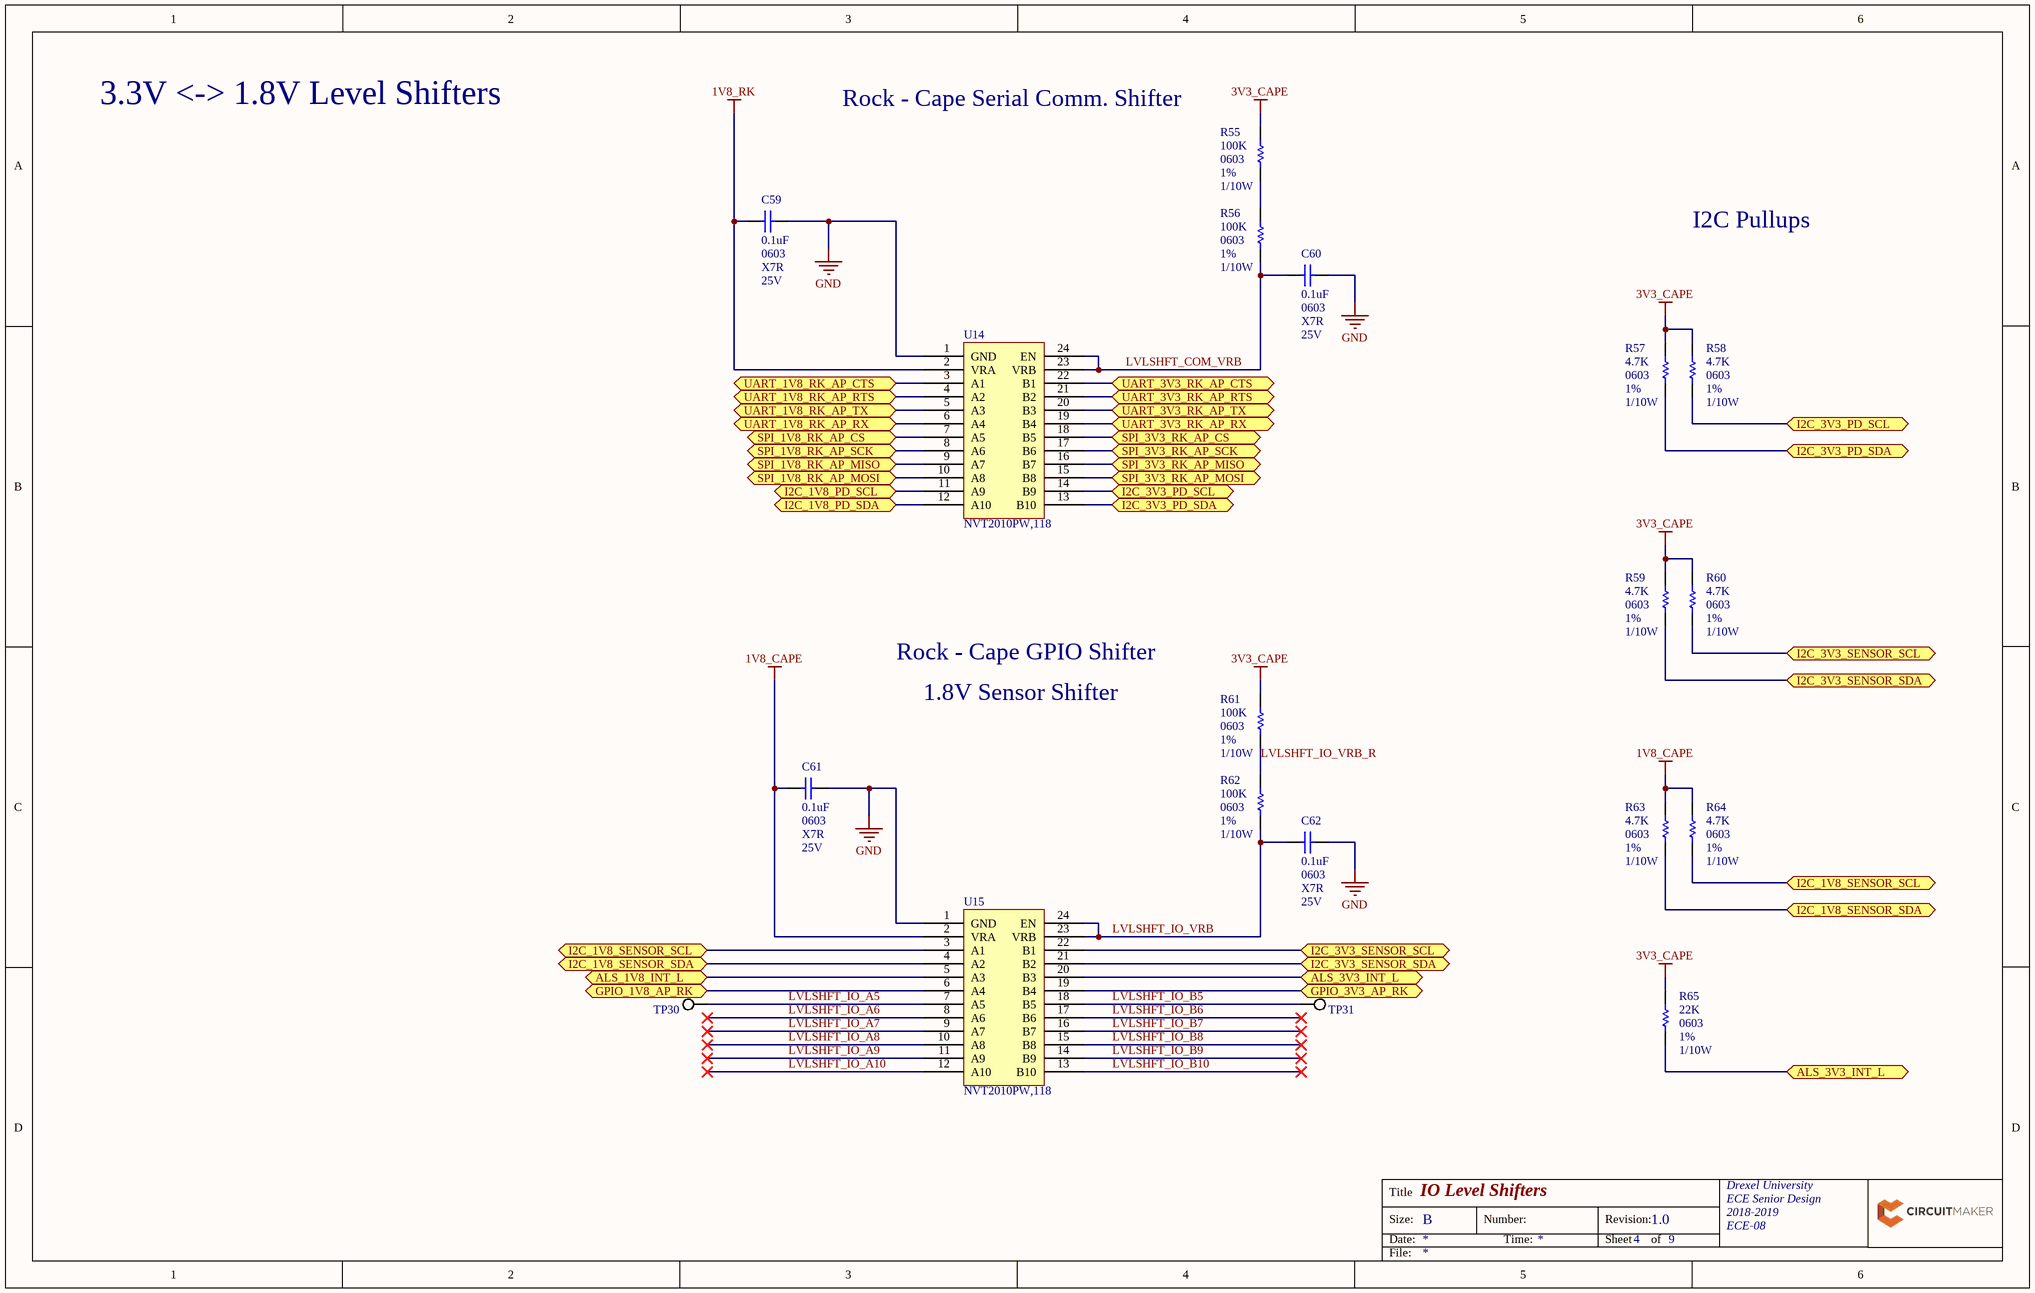
[diagram p3: IO Level Shifters.SchDoc]

### Parts
C59  Dielectric Characteristic: X7R  Voltage Rating (DC): 25V  Capacitance: 0.1uF  Package: 0603  [PCB-8usp83j76ntw2xroyu3n-1]  (hidden comment: Würth Elektronik 885012206071)
C60  Dielectric Characteristic: X7R  Voltage Rating (DC): 25V  Capacitance: 0.1uF  Package: 0603  [PCB-8usp83j76ntw2xroyu3n-1]  (hidden comment: Würth Elektronik 885012206071)
C61  Dielectric Characteristic: X7R  Voltage Rating (DC): 25V  Capacitance: 0.1uF  Package: 0603  [PCB-8usp83j76ntw2xroyu3n-1]  (hidden comment: Würth Elektronik 885012206071)
C62  Dielectric Characteristic: X7R  Voltage Rating (DC): 25V  Capacitance: 0.1uF  Package: 0603  [PCB-8usp83j76ntw2xroyu3n-1]  (hidden comment: Würth Elektronik 885012206071)
R55  Resistance: 100K  Power Rating: 1/10W  Package: 0603  Tolerance: 1%  [PCB-js3e944hkesj3cskg8px-1]  (hidden comment: Res1)
R56  Resistance: 100K  Power Rating: 1/10W  Package: 0603  Tolerance: 1%  [PCB-js3e944hkesj3cskg8px-1]  (hidden comment: Res1)
R57  Resistance: 4.7K  Package: 0603  Power Rating: 1/10W  Tolerance: 1%  [CAPC1608X90X35NL15T15]  (hidden comment: 4k7)
R58  Resistance: 4.7K  Package: 0603  Power Rating: 1/10W  Tolerance: 1%  [CAPC1608X90X35NL15T15]  (hidden comment: 4k7)
R59  Resistance: 4.7K  Package: 0603  Power Rating: 1/10W  Tolerance: 1%  [CAPC1608X90X35NL15T15]  (hidden comment: 4k7)
R60  Resistance: 4.7K  Package: 0603  Power Rating: 1/10W  Tolerance: 1%  [CAPC1608X90X35NL15T15]  (hidden comment: 4k7)
R61  Resistance: 100K  Power Rating: 1/10W  Package: 0603  Tolerance: 1%  [PCB-js3e944hkesj3cskg8px-1]  (hidden comment: Res1)
R62  Resistance: 100K  Power Rating: 1/10W  Package: 0603  Tolerance: 1%  [PCB-js3e944hkesj3cskg8px-1]  (hidden comment: Res1)
R63  Resistance: 4.7K  Package: 0603  Power Rating: 1/10W  Tolerance: 1%  [CAPC1608X90X35NL15T15]  (hidden comment: 4k7)
R64  Resistance: 4.7K  Package: 0603  Power Rating: 1/10W  Tolerance: 1%  [CAPC1608X90X35NL15T15]  (hidden comment: 4k7)
R65  Resistance: 22K  Resistance Tolerance: 1%  Case/Package: 0603  Power Rating: 1/10W  [RESC1608X55X25LL10T15]  (hidden comment: Yageo RC0603FR-0722KL)
TP30  SYM-r3tntvff39g057zxjnnx-1  [PCB-hew5anfrhkqvtgt23eko-1]  (value not drawn)
TP31  SYM-r3tntvff39g057zxjnnx-1  [PCB-hew5anfrhkqvtgt23eko-1]  (value not drawn)
U14  NVT2010PW,118  [PCBComponent_1 - duplicate]
U15  NVT2010PW,118  [PCBComponent_1 - duplicate]

### Ports
ALS_1V8_INT_L, ALS_3V3_INT_L, GPIO_1V8_AP_RK, GPIO_3V3_AP_RK, I2C_1V8_PD_SCL, I2C_1V8_PD_SDA, I2C_1V8_SENSOR_SCL, I2C_1V8_SENSOR_SDA, I2C_3V3_PD_SCL, I2C_3V3_PD_SDA, I2C_3V3_SENSOR_SCL, I2C_3V3_SENSOR_SDA, SPI_1V8_RK_AP_CS, SPI_1V8_RK_AP_MISO, SPI_1V8_RK_AP_MOSI, SPI_1V8_RK_AP_SCK, SPI_3V3_RK_AP_CS, SPI_3V3_RK_AP_MISO, SPI_3V3_RK_AP_MOSI, SPI_3V3_RK_AP_SCK, UART_1V8_RK_AP_CTS, UART_1V8_RK_AP_RTS, UART_1V8_RK_AP_RX, UART_1V8_RK_AP_TX, UART_3V3_RK_AP_CTS, UART_3V3_RK_AP_RTS, UART_3V3_RK_AP_RX, UART_3V3_RK_AP_TX

### Nets
1V8_CAPE: C61.1 R63.2 R64.2 U15.2(VRA)
1V8_RK: C59.1 U14.2(VRA)
3V3_CAPE: R55.2 R57.2 R58.2 R59.2 R60.2 R61.2 R65.2
GND: C59.2 C60.2 C61.2 C62.2 U14.1(GND) U15.1(GND)
ALS_INT: U15.5(A3) ; port ALS_1V8_INT_L
AP_I2C1_SCL: R58.1 U14.14(B9) ; port I2C_3V3_PD_SCL
AP_I2C1_SDA: R57.1 U14.13(B10) ; port I2C_3V3_PD_SDA
AP_I2C2_SCL: R60.1 U15.22(B1) ; port I2C_3V3_SENSOR_SCL
AP_I2C2_SDA: R59.1 U15.21(B2) ; port I2C_3V3_SENSOR_SDA
AP_PA8_RK_GPIO: U15.19(B4) ; port GPIO_3V3_AP_RK
AP_PC1_ALS_INT_L: R65.1 U15.20(B3) ; port ALS_3V3_INT_L
AP_SPI1_MISO: U14.16(B7) ; port SPI_3V3_RK_AP_MISO
AP_SPI1_MOSI: U14.15(B8) ; port SPI_3V3_RK_AP_MOSI
AP_SPI1_SCK: U14.17(B6) ; port SPI_3V3_RK_AP_SCK
AP_SPI1_SLAVE_NSS: U14.18(B5) ; port SPI_3V3_RK_AP_CS
AP_UART2_CTS: U14.21(B2) ; port UART_3V3_RK_AP_RTS
AP_UART2_RTS: U14.22(B1) ; port UART_3V3_RK_AP_CTS
AP_UART2_RX: U14.20(B3) ; port UART_3V3_RK_AP_TX
AP_UART2_TX: U14.19(B4) ; port UART_3V3_RK_AP_RX
LVLSHFT_COM_VRB: C60.1 R56.1 U14.23(VRB) U14.24(EN)
LVLSHFT_IO_A5: TP30.1 U15.7(A5)
LVLSHFT_IO_A6: U15.8(A6)
LVLSHFT_IO_A7: U15.9(A7)
LVLSHFT_IO_A8: U15.10(A8)
LVLSHFT_IO_A9: U15.11(A9)
LVLSHFT_IO_A10: U15.12(A10)
LVLSHFT_IO_B5: TP31.1 U15.18(B5)
LVLSHFT_IO_B6: U15.17(B6)
LVLSHFT_IO_B7: U15.16(B7)
LVLSHFT_IO_B8: U15.15(B8)
LVLSHFT_IO_B9: U15.14(B9)
LVLSHFT_IO_B10: U15.13(B10)
LVLSHFT_IO_VRB: C62.1 R62.1 U15.23(VRB) U15.24(EN)
LVLSHFT_IO_VRB_R: R61.1 R62.2
RK_GPIO0_A6: U15.6(A4) ; port GPIO_1V8_AP_RK
RK_I2C1_SCL: U14.11(A9) ; port I2C_1V8_PD_SCL
RK_I2C1_SDA: U14.12(A10) ; port I2C_1V8_PD_SDA
RK_I2C6_SCL: R64.1 U15.3(A1) ; port I2C_1V8_SENSOR_SCL
RK_I2C6_SDA: R63.1 U15.4(A2) ; port I2C_1V8_SENSOR_SDA
RK_SPI0_CLK: U14.8(A6) ; port SPI_1V8_RK_AP_SCK
RK_SPI0_CS: U14.7(A5) ; port SPI_1V8_RK_AP_CS
RK_SPI0_MISO: U14.9(A7) ; port SPI_1V8_RK_AP_MISO
RK_SPI0_MOSI: U14.10(A8) ; port SPI_1V8_RK_AP_MOSI
RK_UART3_CTS: U14.3(A1) ; port UART_1V8_RK_AP_CTS
RK_UART3_RTS: U14.4(A2) ; port UART_1V8_RK_AP_RTS
RK_UART3_RX: U14.6(A4) ; port UART_1V8_RK_AP_RX
RK_UART3_TX: U14.5(A3) ; port UART_1V8_RK_AP_TX
NetR55_1: R55.1 R56.2

### Notes on the sheet
- 3.3V <-> 1.8V Level Shifters
- (near R55) Rock - Cape Serial Comm. Shifter
- I2C Pullups
- Rock - Cape GPIO Shifter
- 1.8V Sensor Shifter
- Title
- Size:
- Date:
- B
- Number:
- Time:
- Revision:
- Sheet
- of
- File:

### Library data of the parts
C59-C62 = CMP-034ac9768ab0dc8d-1: Multilayer Ceramic Capacitor, WCAP-CSGP Series, 0.1 F, 10%, X7R, 25 V, 0603 [1608 Metric]; RoHS: Compliant; Capacitance Tolerance: ±10%; OctopartID: 034ac9768ab0dc8d; Packaging: Cut Tape (CT); Octopart URL: http://octopart.com/885012206071-w%C3%BCrth+elektronik-53914780; Manufacturer Part Number: 885012206071
R55 R56 R61 R62 = CMP-47e38e6423219824-1: Res Thick Film 0603 100K Ohm 1% 0.1W(1/10W) ±100ppm/C Pad SMD T/R
R57-R60 R63 R64 = CMP-3ca7f596181de360-9: Res Thick Film 0603 4.7K Ohm 1% 1/10W ±100ppm/°C Molded SMD SMD Paper Tape on Plastic Reel
R65 = CMP-1853446-5: Chip Resistor, 22 KOhm, +/- 1%, 0.1 W, -55 to 155 degC, 0603 (1608 Metric), RoHS, Tape and Reel; Voltage Rating (DC): 50.0 V; Lead-Free Status: Lead Free; Case/Package (SI): 1608; Number of Pins: 2; Size-Height: 450 µm; PackageDescription: 2-Pin Surface Mount Device, Body 1.6 x 0.8 mm; Size-Width: 800 µm; Seller Landing  Url: https://octopart-clicks.com/click/track?country=US&ak=8157f166&sig=0952a08&sid=5489&ppid=40952860&vpid=270386233&ct=offers; DatasheetVersion: Rev. 4, 02/2016; PackageReference: 0603; Size-Length: 1.60 mm; RoHS: Compliant; Mounting Style: Surface Mount; OctopartID: 2162ea18e018fea5; Manufacturer Part Number: RC0603FR-0722KL; Packaging: Cut Tape (CT), Tape & Reel (TR); Octopart Url: http://octopart.com/rc0603fr-0722kl-yageo-40952860; REACH SVHC Compliance: No SVHC
TP30 TP31 = CMP-r3tntvff39g057zxjnnx-3: SMT Pad Test Point 1.27mm Diameter
U14 U15 = CMP-e872205300dc37b5-1: Voltage Level Translator 24-Pin TSSOP T/R; Supply Voltage (DC): 5.50 V (max), 1.80 V (min); Lead-Free Status: Lead Free; Lifecycle Status: Active; OctopartID: e872205300dc37b5; Octopart URL: https://octopart.com/nvt2010pw%2C118-nxp+semiconductors-19647944; Manufacturer Part Number: NVT2010PW,118

## Sheet USB to UART Bridge.SchDoc: USB to UART Bridge
size B; Organization: Drexel University; Address1: ECE Senior Design; Address2: 2018-2019; Address3: ECE-08; Revision: 1.0; SheetNumber: 5; SheetTotal: 9
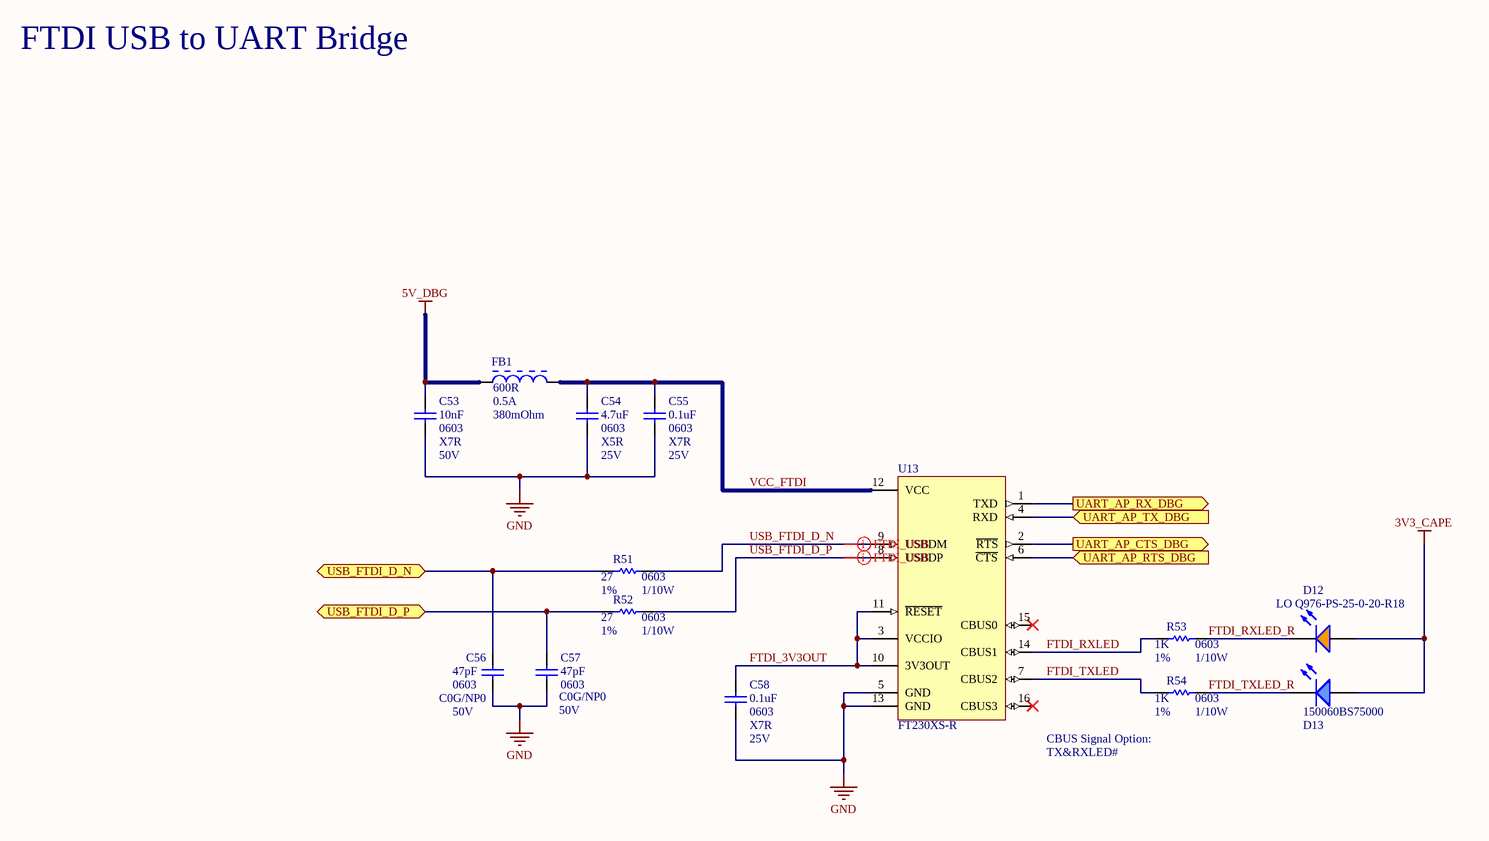
[diagram p4: USB to UART Bridge.SchDoc]

### Parts
C53  Capacitance: 10nF  Package: 0603  Voltage Rating: 50V  Temperature Coefficient: X7R  [PCB-d5hkaaevye8vfvwu9osi-1]  (hidden comment: Cap)
C54  Capacitance: 4.7uF  Case/Package: 0603  Dielectric Characteristic: X5R  Voltage Rating (DC): 25V  [CAPC1608X90X35ML10T15]  (hidden comment: Murata GRM188R61E475KE11D)
C55  Dielectric Characteristic: X7R  Voltage Rating (DC): 25V  Capacitance: 0.1uF  Package: 0603  [PCB-8usp83j76ntw2xroyu3n-1]  (hidden comment: Würth Elektronik 885012206071)
C56  Capacitance: 47pF  Dielectric Characteristic: C0G/NP0  Voltage Rating (DC): 50V  Package: 0603  [PCB-6hp2bdit6vqlyhs5eujf-1]  (hidden comment: Würth Elektronik 885012006055)
C57  Capacitance: 47pF  Dielectric Characteristic: C0G/NP0  Voltage Rating (DC): 50V  Package: 0603  [PCB-6hp2bdit6vqlyhs5eujf-1]  (hidden comment: Würth Elektronik 885012006055)
C58  Dielectric Characteristic: X7R  Voltage Rating (DC): 25V  Capacitance: 0.1uF  Package: 0603  [PCB-8usp83j76ntw2xroyu3n-1]  (hidden comment: Würth Elektronik 885012206071)
D12  LO Q976-PS-25-0-20-R18  [PCB-zc2vv3u4p0giaiwimi3e-1]
D13  150060BS75000  [PCB-q13q7q9xcpj9ke5g4s5g-1]
FB1  Impedance: 600R  Current Rating: 0.5A  DCR: 380mOhm  [PCB-4foxbpplo5x4nzr4ivga-1]  (hidden comment: SYM-440c8e25a3239bcb-1)
R51  Resistance: 27  Power Rating: 1/10W  Case/Package: 0603  Resistance Tolerance: 1%  [0603-RES]  (hidden comment: Panasonic / Panasonic ECG ERJ-3EKF27R0V)
R52  Resistance: 27  Power Rating: 1/10W  Case/Package: 0603  Resistance Tolerance: 1%  [0603-RES]  (hidden comment: Panasonic / Panasonic ECG ERJ-3EKF27R0V)
R53  Case/Package: 0603  Power Rating: 1/10W  Resistance: 1K  Resistance Tolerance: 1%  [PCB-rzdzs5ckhrcob8ss0hvn-1]  (hidden comment: Stackpole Electronics RMCF0603FT1K00)
R54  Case/Package: 0603  Power Rating: 1/10W  Resistance: 1K  Resistance Tolerance: 1%  [PCB-rzdzs5ckhrcob8ss0hvn-1]  (hidden comment: Stackpole Electronics RMCF0603FT1K00)
U13  FT230XS-R  [SSOP16-0.635-5X4MM]

### Ports
UART_AP_CTS_DBG (out), UART_AP_RTS_DBG (in), UART_AP_RX_DBG (out), UART_AP_TX_DBG (in), USB_FTDI_D_N, USB_FTDI_D_P (bidir)

### Nets
3V3_CAPE: D12.1(A) D13.2(A)
5V_DBG: C53.2 FB1.1
GND: C53.1 C54.1 C55.1 C56.1 C57.1 C58.1 U13.5(GND) U13.13(GND)
AP_UART1_CTS: U13.2(~{RTS}) ; port UART_AP_CTS_DBG
AP_UART1_RTS: U13.6(~{CTS}) ; port UART_AP_RTS_DBG
AP_UART1_RX: U13.1(TXD) ; port UART_AP_RX_DBG
AP_UART1_TX: U13.4(RXD) ; port UART_AP_TX_DBG
FTDI_3V3OUT: C58.2 U13.3(VCCIO) U13.10(3V3OUT) U13.11(~{RESET})
FTDI_RXLED: R53.2 U13.14(CBUS1)
FTDI_RXLED_R: D12.2(K) R53.1
FTDI_TXLED: R54.2 U13.7(CBUS2)
FTDI_TXLED_R: D13.1(K) R54.1
USB_FTDI_D_N: R51.2 U13.9(USBDM)
USB_FTDI_D_P: R52.2 U13.8(USBDP)
USB_MICRO_D_N: C56.2 R51.1 ; port USB_FTDI_D_N
USB_MICRO_D_P: C57.2 R52.1 ; port USB_FTDI_D_P
VCC_FTDI: C54.2 C55.2 FB1.2 U13.12(VCC)

Not connected (* = marked no-connect by the designer): U13 15(CBUS0)* 16(CBUS3)*

### Layout directives
differential pair: USB_FTDI_D_N, USB_FTDI_D_P

### Notes on the sheet
- FTDI USB to UART Bridge
- CBUS Signal Option:
- TX&RXLED#
- Title
- Size:
- Date:
- B
- Number:
- Time:
- Revision:
- Sheet
- of
- File:

### Library data of the parts
C53 = CMP-96115e35287049d6-7: CL10 Series 0603 50 V 10 nF X7R ±10% Tolerance Multilayer Ceramic Capacitor; Capacitance Tolerance: ±10%
C54 = CMP-8856396-4: CAP CER 4.7UF 25V 10% X5R 0603; Capacitance Tolerance: ±10%; Lifecycle Status: Active; Octopart Url: https://octopart.com/grm188r61e475ke11d-murata-26982327; OctopartID: 0176c9e793a7deb1; Packaging: Cut Tape (CT); REACH SVHC Compliance: No SVHC; RoHS: Compliant; Size-Length: 0.0016 m; Size-Thickness: 0.0008 m; Size-Width: 0.0008 m; Manufacturer Part Number: GRM188R61E475KE11D
C55 C58 = CMP-034ac9768ab0dc8d-1: as C59 on sheet IO Level Shifters; RoHS: Compliant; Capacitance Tolerance: ±10%; OctopartID: 034ac9768ab0dc8d; Packaging: Cut Tape (CT); Octopart URL: http://octopart.com/885012206071-w%C3%BCrth+elektronik-53914780; Manufacturer Part Number: 885012206071
C56 C57 = CMP-bdcf7723a1936208-1: Cap, Mlcc, Np0, 47Pf, 50V, 0603; Capacitance Tolerance: ±5%; Octopart URL: https://octopart.com/885012006055-w%C3%BCrth+elektronik-65419578; Manufacturer Part Number: 885012006055; Operating Temperature: -55.0 °C (min); Packaging: Cut Tape (CT); RoHS: Compliant; OctopartID: bdcf7723a1936208
D12 = CMP-b572780b9ff46ab5-2: LED Uni-Color Orange 0.74lm 610nm Chip LED 2-Pin SMD T/R; OctopartID: b572780b9ff46ab5; Manufacturer Part Number: LO Q976-PS-25-0-20-R18; Octopart URL: https://octopart.com/lo+q976-ps-25-0-20-r18-osram+opto-74649568
D13 = CMP-12518856-7: Standard LEDs - SMD WL-SMCW SMDMono TpVw Waterclr 0603 Blue; Viewing Angle: 140 °; Luminous Intensity: 145 mcd; Forward Voltage: 3.20 V; Case/Package: 0603; Color: Blue; Octopart URL: http://octopart.com/150060bs75000-w%C3%BCrth+elektronik-29717775; RoHS: Compliant; Mounting Style: Surface Mount; Manufacturer Part Number: 150060BS75000; OctopartID: cf0a07c59f6310cd; Packaging: Cut Tape (CT)
FB1 = CMP-440c8e25a3239bcb-1: Ind Chip Bead Multi-Layer 600 Ohm 25% 100MHz Ferrite 500mA 0603 T/R; Manufacturer Part Number: PE-0603FB601ST; OctopartID: 440c8e25a3239bcb
R51 R52 = CMP-f61f3f990ffb29d8-2: Res Thick Film 0603 27 Ohm 1% 0.1W(1/10W) ±100ppm/C Molded SMD Automotive Punched T/R; Lead-Free Status: Lead Free; Voltage Rating (DC): 75.0 V; Manufacturer Part Number: ERJ-3EKF27R0V; RoHS: Compliant; OctopartID: f61f3f990ffb29d8; Number of Pins: 2; Mounting Style: Surface Mount; Seller Landing  Url: https://octopart-clicks.com/click/track?country=US&ak=8157f166&sig=00bb2fd&sid=459&ppid=9231490&vpid=115259536&ct=offers; Lifecycle Status: Not Listed by Manufacturer; Octopart Url: http://octopart.com/erj-3ekf27r0v-panasonic-9231490; REACH SVHC Compliance: No SVHC; Packaging: Tape & Reel (TR), Cut Tape (CT)
R53 R54 = CMP-fdb3359cf2042274-2: RMCF Series 0603 0.1 W 1 kOhm ±1 % ±100 ppm/°C SMT Thick Film Chip Resistor; Lead-Free Status: Lead Free; Packaging: Tape & Reel (TR); Octopart URL: http://octopart.com/rmcf0603ft1k00-stackpole+electronics-19213009; Mounting Style: Surface Mount; OctopartID: fdb3359cf2042274; RoHS: Compliant; Manufacturer Part Number: RMCF0603FT1K00
U13 = CMP-1315826-9: Interface; USB-basic UART; Number of pins CBUS: 4; tape; SSOP16; Company: FTDI; OctopartID: 8b06435c0fa154c1; Mounting Style: Surface Mount; Manufacturer Part Number: FT230XS-R; Octopart Url: http://octopart.com/ft230xs-r-ftdi-22061505; Seller Landing  Url: https://octopart-clicks.com/click/track?country=US&ak=8157f166&sig=0eeb63a&sid=5489&ppid=22061505&vpid=88166844&ct=offers; Packaging: Tape; RoHS: Compliant

## Sheet USB Type C Power Controller.SchDoc: USB Type C Power Controller
size B; Organization: Drexel University; Address1: ECE Senior Design; Address2: 2018-2019; Address3: ECE-08; Revision: 1.0; SheetNumber: 6; SheetTotal: 9
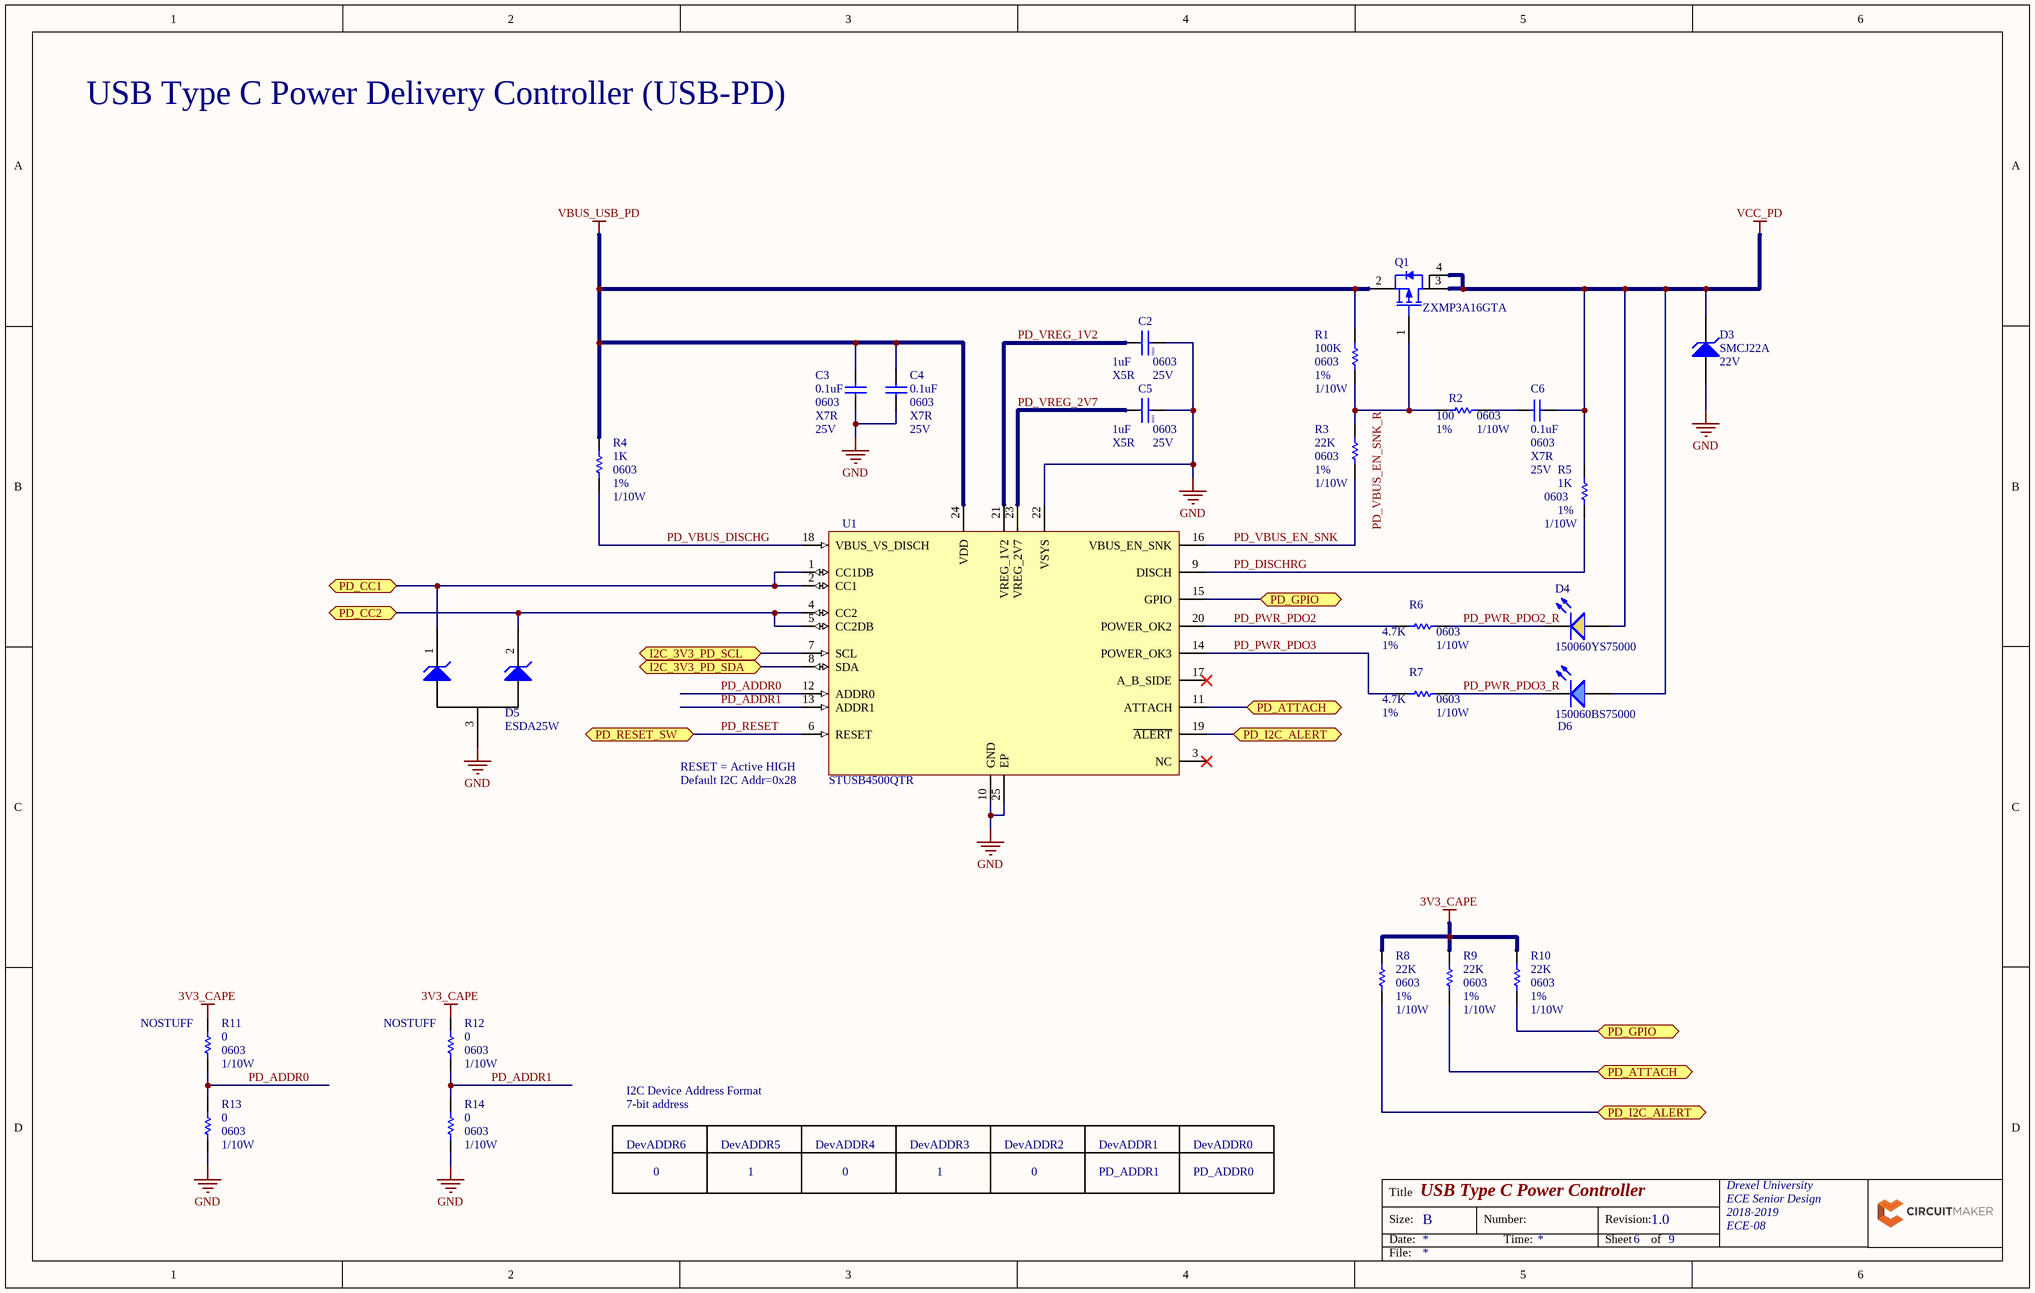
[diagram p5: USB Type C Power Controller.SchDoc]

### Parts
C2  Case/Package: 0603  Dielectric Characteristic: X5R  Capacitance: 1uF  Voltage Rating (DC): 25V  [PCB-bncvufzharetcg4gy1u6-1]  (hidden comment: Taiyo Yuden TMK107BJ105KA-T)
C3  Dielectric Characteristic: X7R  Voltage Rating (DC): 25V  Capacitance: 0.1uF  Package: 0603  [PCB-8usp83j76ntw2xroyu3n-1]  (hidden comment: Würth Elektronik 885012206071)
C4  Dielectric Characteristic: X7R  Voltage Rating (DC): 25V  Capacitance: 0.1uF  Package: 0603  [PCB-8usp83j76ntw2xroyu3n-1]  (hidden comment: Würth Elektronik 885012206071)
C5  Case/Package: 0603  Dielectric Characteristic: X5R  Capacitance: 1uF  Voltage Rating (DC): 25V  [PCB-bncvufzharetcg4gy1u6-1]  (hidden comment: Taiyo Yuden TMK107BJ105KA-T)
C6  Dielectric Characteristic: X7R  Voltage Rating (DC): 25V  Capacitance: 0.1uF  Package: 0603  [PCB-8usp83j76ntw2xroyu3n-1]  (hidden comment: Würth Elektronik 885012206071)
D3  SMCJ22A  Reverse Voltage: 22V  [PCB-gk7qhtajnaxh6qo3xtq4-1]
D4  150060YS75000  [PCB-pyamyqkabampf41w6k2s-1]
D5  Manufacturer Part Number: ESDA25W  [SOT65P210X110-3N]  (hidden comment: D Zener)
D6  150060BS75000  [PCB-q13q7q9xcpj9ke5g4s5g-1]
Q1  Manufacturer Part Number: ZXMP3A16GTA  [SOT230P700X160-4N]  (hidden comment: SYM-6957a0575e87b690-1)
R1  Resistance: 100K  Power Rating: 1/10W  Package: 0603  Tolerance: 1%  [PCB-js3e944hkesj3cskg8px-1]  (hidden comment: Res1)
R2  Case/Package: 0603  Power Rating: 1/10W  Resistance: 100  Resistance Tolerance: 1%  [PCB-85l72t2kcrpp9pohrqyw-1]  (hidden comment: Stackpole Electronics RMCF0603FG100R)
R3  Resistance: 22K  Resistance Tolerance: 1%  Case/Package: 0603  Power Rating: 1/10W  [RESC1608X55X25LL10T15]  (hidden comment: Yageo RC0603FR-0722KL)
R4  Case/Package: 0603  Power Rating: 1/10W  Resistance: 1K  Resistance Tolerance: 1%  [PCB-rzdzs5ckhrcob8ss0hvn-1]  (hidden comment: Stackpole Electronics RMCF0603FT1K00)
R5  Case/Package: 0603  Power Rating: 1/10W  Resistance: 1K  Resistance Tolerance: 1%  [PCB-rzdzs5ckhrcob8ss0hvn-1]  (hidden comment: Stackpole Electronics RMCF0603FT1K00)
R6  Resistance: 4.7K  Package: 0603  Power Rating: 1/10W  Tolerance: 1%  [CAPC1608X90X35NL15T15]  (hidden comment: 4k7)
R7  Resistance: 4.7K  Package: 0603  Power Rating: 1/10W  Tolerance: 1%  [CAPC1608X90X35NL15T15]  (hidden comment: 4k7)
R8  Resistance: 22K  Resistance Tolerance: 1%  Case/Package: 0603  Power Rating: 1/10W  [RESC1608X55X25LL10T15]  (hidden comment: Yageo RC0603FR-0722KL)
R9  Resistance: 22K  Resistance Tolerance: 1%  Case/Package: 0603  Power Rating: 1/10W  [RESC1608X55X25LL10T15]  (hidden comment: Yageo RC0603FR-0722KL)
R10  Resistance: 22K  Resistance Tolerance: 1%  Case/Package: 0603  Power Rating: 1/10W  [RESC1608X55X25LL10T15]  (hidden comment: Yageo RC0603FR-0722KL)
R11  Supplier Device Package: 0603  Resistance: 0  Power: 1/10W  [PCB-vghjuybc2rzv8513tm8h-1]  (hidden comment: Res1)
R12  Supplier Device Package: 0603  Resistance: 0  Power: 1/10W  [PCB-vghjuybc2rzv8513tm8h-1]  (hidden comment: Res1)
R13  Supplier Device Package: 0603  Resistance: 0  Power: 1/10W  [PCB-vghjuybc2rzv8513tm8h-1]  (hidden comment: Res1)
R14  Supplier Device Package: 0603  Resistance: 0  Power: 1/10W  [PCB-vghjuybc2rzv8513tm8h-1]  (hidden comment: Res1)
U1  STUSB4500QTR  [PCB-xnkkl1130v2ws1vguio4-1]

### Ports
I2C_3V3_PD_SCL (bidir), I2C_3V3_PD_SDA (bidir), PD_ATTACH, PD_CC1 (bidir), PD_CC2 (bidir), PD_GPIO, PD_I2C_ALERT, PD_RESET_SW (bidir)

### Nets
3V3_CAPE: R8.2 R9.2 R10.2 R11.2 R12.2
GND: C2.2 C3.1 C4.1 C5.2 D3.1(A) D5.3 R13.1 R14.1 U1.10(GND) U1.22(VSYS) U1.25(EP)
VBUS_USB_PD: C3.2 C4.2 Q1.2(S) R1.2 R4.2 U1.24(VDD)
VCC_PD: C6.2 D3.2(K) D4.2(A) D6.2(A) Q1.3(D) Q1.4 R5.2
AP_I2C1_SCL: U1.7(SCL) ; port I2C_3V3_PD_SCL
AP_I2C1_SDA: U1.8(SDA) ; port I2C_3V3_PD_SDA
AP_PB4_PD_ATTACH: R9.1 U1.11(ATTACH) ; port PD_ATTACH
AP_PB5_PD_I2C_ALERT: R8.1 U1.19(~{ALERT}) ; port PD_I2C_ALERT
AP_PB8_PD_GPIO: R10.1 U1.15(GPIO) ; port PD_GPIO
PD_ADDR0: R11.1 R13.2 U1.12(ADDR0)
PD_ADDR1: R12.1 R14.2 U1.13(ADDR1)
PD_DISCHRG: R5.1 U1.9(DISCH)
PD_PWR_PDO2: R6.1 U1.20(POWER_OK2)
PD_PWR_PDO2_R: D4.1(K) R6.2
PD_PWR_PDO3: R7.1 U1.14(POWER_OK3)
PD_PWR_PDO3_R: D6.1(K) R7.2
PD_RESET: U1.6(RESET) ; port PD_RESET_SW
PD_VBUS_DISCHG: R4.1 U1.18(VBUS_VS_DISCH)
PD_VBUS_EN_SNK: R3.1 U1.16(VBUS_EN_SNK)
PD_VBUS_EN_SNK_R: Q1.1(G) R1.1 R2.1 R3.2
PD_VREG_1V2: C2.1 U1.21(VREG_1V2)
PD_VREG_2V7: C5.1 U1.23(VREG_2V7)
USBC_CC1: D5.1 U1.1(CC1DB) U1.2(CC1) ; port PD_CC1
USBC_CC2: D5.2 U1.4(CC2) U1.5(CC2DB) ; port PD_CC2
NetC6_1: C6.1 R2.2

Not connected (* = marked no-connect by the designer): U1 3(NC)* 17(A_B_SIDE)*

### Notes on the sheet
- USB Type C Power Delivery Controller (USB-PD)
- (near U1) RESET = Active HIGH
- (near U1) Default I2C Addr=0x28
- I2C Device Address Format
- 7-bit address
- DevADDR6
- 0
- DevADDR5
- 1
- DevADDR4
- DevADDR3
- DevADDR2
- DevADDR1
- PD_ADDR1
- DevADDR0
- PD_ADDR0
- Title
- Size:
- Date:
- B
- Number:
- Time:
- Revision:
- Sheet
- of
- File:
- (in symbol CMP-536b9a7387ce8cac-9) NOSTUFF

### Library data of the parts
C2 C5 = CMP-ac4e65478e587389-1: Cap Ceramic 1uF 25V X5R 10% SMD 0603 85°C Paper T/R; Lead-Free Status: Lead Free; Octopart URL: http://octopart.com/tmk107bj105ka-t-taiyo+yuden-198512; Packaging: Cut Tape (CT); Size-Width: 800 µm; Halogen Free Status: Halogen Free; Size-Length: 1.60 mm; Capacitance Tolerance: ±10%; OctopartID: ac4e65478e587389; Size-Height: 800 µm; Mounting Style: Surface Mount; Manufacturer Part Number: TMK107BJ105KA-T; Lifecycle Status: Active; Number of Pins: 2; RoHS: Compliant
C3 C4 C6 = CMP-034ac9768ab0dc8d-1: as C59 on sheet IO Level Shifters; RoHS: Compliant; Capacitance Tolerance: ±10%; OctopartID: 034ac9768ab0dc8d; Packaging: Cut Tape (CT); Octopart URL: http://octopart.com/885012206071-w%C3%BCrth+elektronik-53914780; Manufacturer Part Number: 885012206071
D3 = CMP-9cf25530e9434335-1: as D2 on sheet Board Connectors
D4 = CMP-12518863-3: Standard LEDs - SMD WL-SMCW SMDMono TpVw Waterclr 0603 Yellow; Forward Voltage: 2.00 V; Packaging: Tape & Reel (TR); Mounting Style: Surface Mount; Manufacturer Part Number: 150060YS75000; RoHS: Compliant
D5 = CMP-6dd1a4de068db216-2: ESD Suppressor TVS Uni-Dir 24V Automotive 3-Pin SOT-323 T/R; Voltage Rating (DC): 25.0 V; Power Rating: 150 W; Breakdown Voltage: 30.0 V (max); Lead-Free Status: Lead Free; Operating Voltage: 1.20 V; OctopartID: 6dd1a4de068db216; Mounting Style: Surface Mount; RoHS: Compliant; Size-Height: 1.10 mm; Case/Package: SOT-323; Packaging: Cut Tape (CT); Number of Pins: 3; Lifecycle Status: Active; Size-Width: 1.35 mm; Size-Length: 2.20 mm
D6 = CMP-12518856-7: as D13 on sheet USB to UART Bridge; Case/Package: 0603; Color: Blue; Octopart URL: http://octopart.com/150060bs75000-w%C3%BCrth+elektronik-29717775; RoHS: Compliant; Mounting Style: Surface Mount; Manufacturer Part Number: 150060BS75000; OctopartID: cf0a07c59f6310cd; Packaging: Cut Tape (CT)
Q1 = CMP-6957a0575e87b690-4: Trans MOSFET P-CH 30V 7.5A Automotive 4-Pin(3+Tab) SOT-223 T/R; Current Rating: -7.50 A; Rise Time: 3.82 ns; Drain to Source Voltage (Vds): 30.0 V; Power Dissipation: 2.00 W; Drain to Source Resistance (on) (Rds): 45.0 mΩ; Continuous Drain Current (Ids): 7.50 A; Voltage Rating (DC): -30.0 V; Lifecycle Status: Active; Octopart URL: https://octopart.com/zxmp3a16gta-diodes+inc.-660150; RoHS: Compliant; Case/Package: SOT-223; OctopartID: 6957a0575e87b690; Mounting Style: Surface Mount
R1 = CMP-47e38e6423219824-1: as R55 on sheet IO Level Shifters
R2 = CMP-39aef181352de669-1: Res Thick Film 0603 100 Ohm 1% 0.1W(1/10W) ±100ppm/C Pad SMD Automotive T/R; Lead-Free Status: Lead Free; Octopart URL: https://octopart.com/rmcf0603fg100r-stackpole+electronics-19212773; Manufacturer Part Number: RMCF0603FG100R; Mounting Style: Surface Mount; Packaging: Tape & Reel (TR); RoHS: Compliant; OctopartID: 39aef181352de669
R3 R8-R10 = CMP-1853446-5: as R65 on sheet IO Level Shifters; Number of Pins: 2; Size-Height: 450 µm; PackageDescription: 2-Pin Surface Mount Device, Body 1.6 x 0.8 mm; Size-Width: 800 µm; Seller Landing  Url: https://octopart-clicks.com/click/track?country=US&ak=8157f166&sig=0952a08&sid=5489&ppid=40952860&vpid=270386233&ct=offers; DatasheetVersion: Rev. 4, 02/2016; PackageReference: 0603; Size-Length: 1.60 mm; RoHS: Compliant; Mounting Style: Surface Mount; OctopartID: 2162ea18e018fea5; Manufacturer Part Number: RC0603FR-0722KL; Packaging: Cut Tape (CT), Tape & Reel (TR); Octopart Url: http://octopart.com/rc0603fr-0722kl-yageo-40952860; REACH SVHC Compliance: No SVHC
R4 R5 = CMP-fdb3359cf2042274-2: as R53 on sheet USB to UART Bridge; Packaging: Tape & Reel (TR); Octopart URL: http://octopart.com/rmcf0603ft1k00-stackpole+electronics-19213009; Mounting Style: Surface Mount; OctopartID: fdb3359cf2042274; RoHS: Compliant; Manufacturer Part Number: RMCF0603FT1K00
R6 R7 = CMP-3ca7f596181de360-9: as R57 on sheet IO Level Shifters
R11-R14 = CMP-536b9a7387ce8cac-9: RES SMD 0 OHM JUMPER 1/10W 0603; Manufacturer Part Number: RC0603JR-070RL; Package / Case: 0603; Size / Dimension: 0.063" L x 0.032" W (1.60mm x 0.80mm); Features: Moisture Resistant; Series: RC
U1 = CMP-366efa1c2a7ce9a9-7: USB Type C and PD Sink Controller USB1.0/USB1.2/USB2.0/USB3.0 24-Pin QFN EP T/R